# Altium project CM5 Nas.PrjPcb (part 1 of 2)
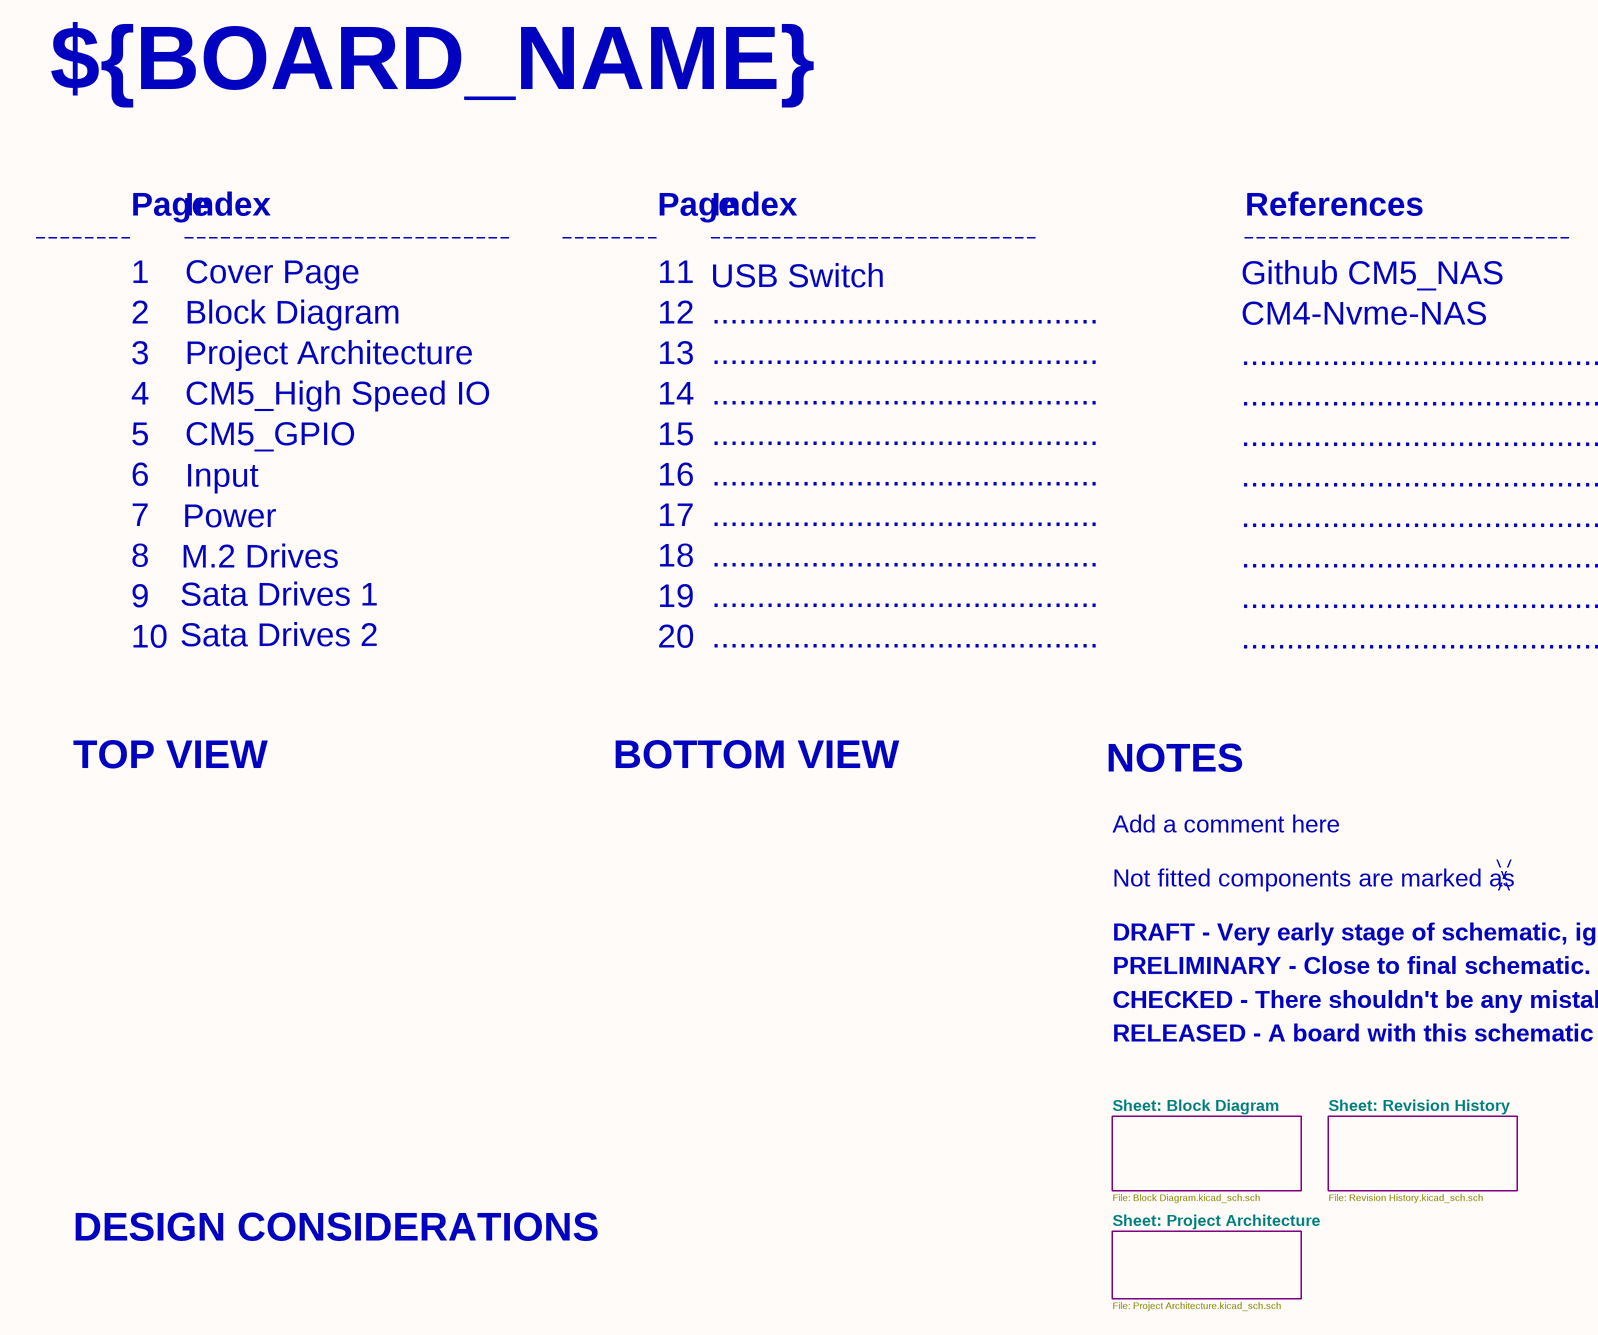
[diagram p0: CM5 Nas.SchDoc, left]
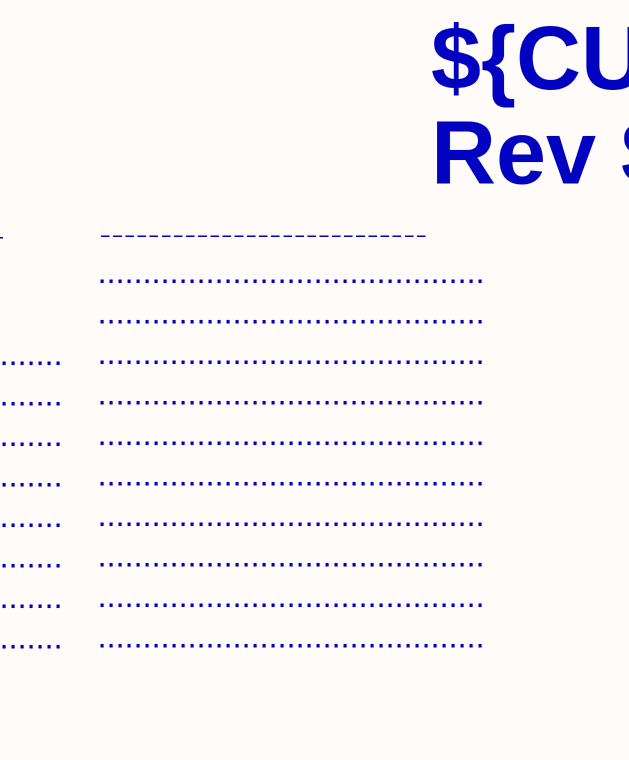
[diagram p1: CM5 Nas.SchDoc, right]
12 sheets, 380 parts. Net scope: flat (ports and power ports of the same name join across sheets).
Board file: CM5 Nas.PcbDoc
Sheets:
  CM5 Nas.SchDoc
    Block Diagram = Block Diagram.SchDoc
    Revision History = Revision History.SchDoc
    Project Architecture = Project Architecture.SchDoc
      M.2 Drives = Drives_M.2.SchDoc
      Sata Drives 2 = Sata_Drives2.SchDoc
      Power = Power.SchDoc
      Usb Switch = USB & Ethernet.SchDoc
      CM5_High Speed IO = Section A - Title A.SchDoc
      Sata Drives 1 = Sata_Drives.SchDoc
      CM5_GPIO = Section B - TItle B.SchDoc
      Input = untitled.SchDoc

## Sheet CM5 Nas.SchDoc
size 420 x 297 mm

### Sub-sheets
Block Diagram = Block Diagram.SchDoc: no entries
Project Architecture = Project Architecture.SchDoc: no entries
Revision History = Revision History.SchDoc: no entries

### Notes on the sheet
- ${BOARD_NAME}
- ${CURRENT_DATE}
- Page
- Index
- References
- Rev ${REVISION}
- 1
- Cover Page
- 11
- Github CM5_NAS
- ...........................................
- 2
- Block Diagram
- 12
- USB Switch
- CM4-Nvme-NAS
- 3
- 4
- CM5_High Speed IO
- Project Architecture
- 13
- 14
- 6
- 5
- CM5_GPIO
- 15
- 16
- 7
- Power
- Input
- 17
- 9
- 8
- Sata Drives 1
- M.2 Drives
- 18
- 19
- 10
- Sata Drives 2
- 20
- TOP VIEW
- BOTTOM VIEW
- NOTES
- Not fitted components are marked as
- Add a comment here
- DRAFT - Very early stage of schematic, ignore details.
- PRELIMINARY - Close to final schematic.
- CHECKED - There shouldn't be any mistakes. Contact the engineer if you find any.
- RELEASED - A board with this schematic has been sent to production.
- Sheet: Block Diagram
- Sheet: Revision History
- File: Block Diagram.kicad_sch.sch
- Sheet: Project Architecture
- File: Revision History.kicad_sch.sch
- DESIGN CONSIDERATIONS
- File: Project Architecture.kicad_sch.sch
- A
- B
- C
- D
- E
- Title: Cover Page
- File: CM5 Nas.kicad_sch
- Sheet: /
- F
- KiCad E.D.A.  kicad (5.1.4)-1
- Size: A3
- Date: Last Modified Date
- Rev: ${REVISION}
- Id: 1/1

## Sheet Block Diagram.SchDoc
size 420 x 297 mm
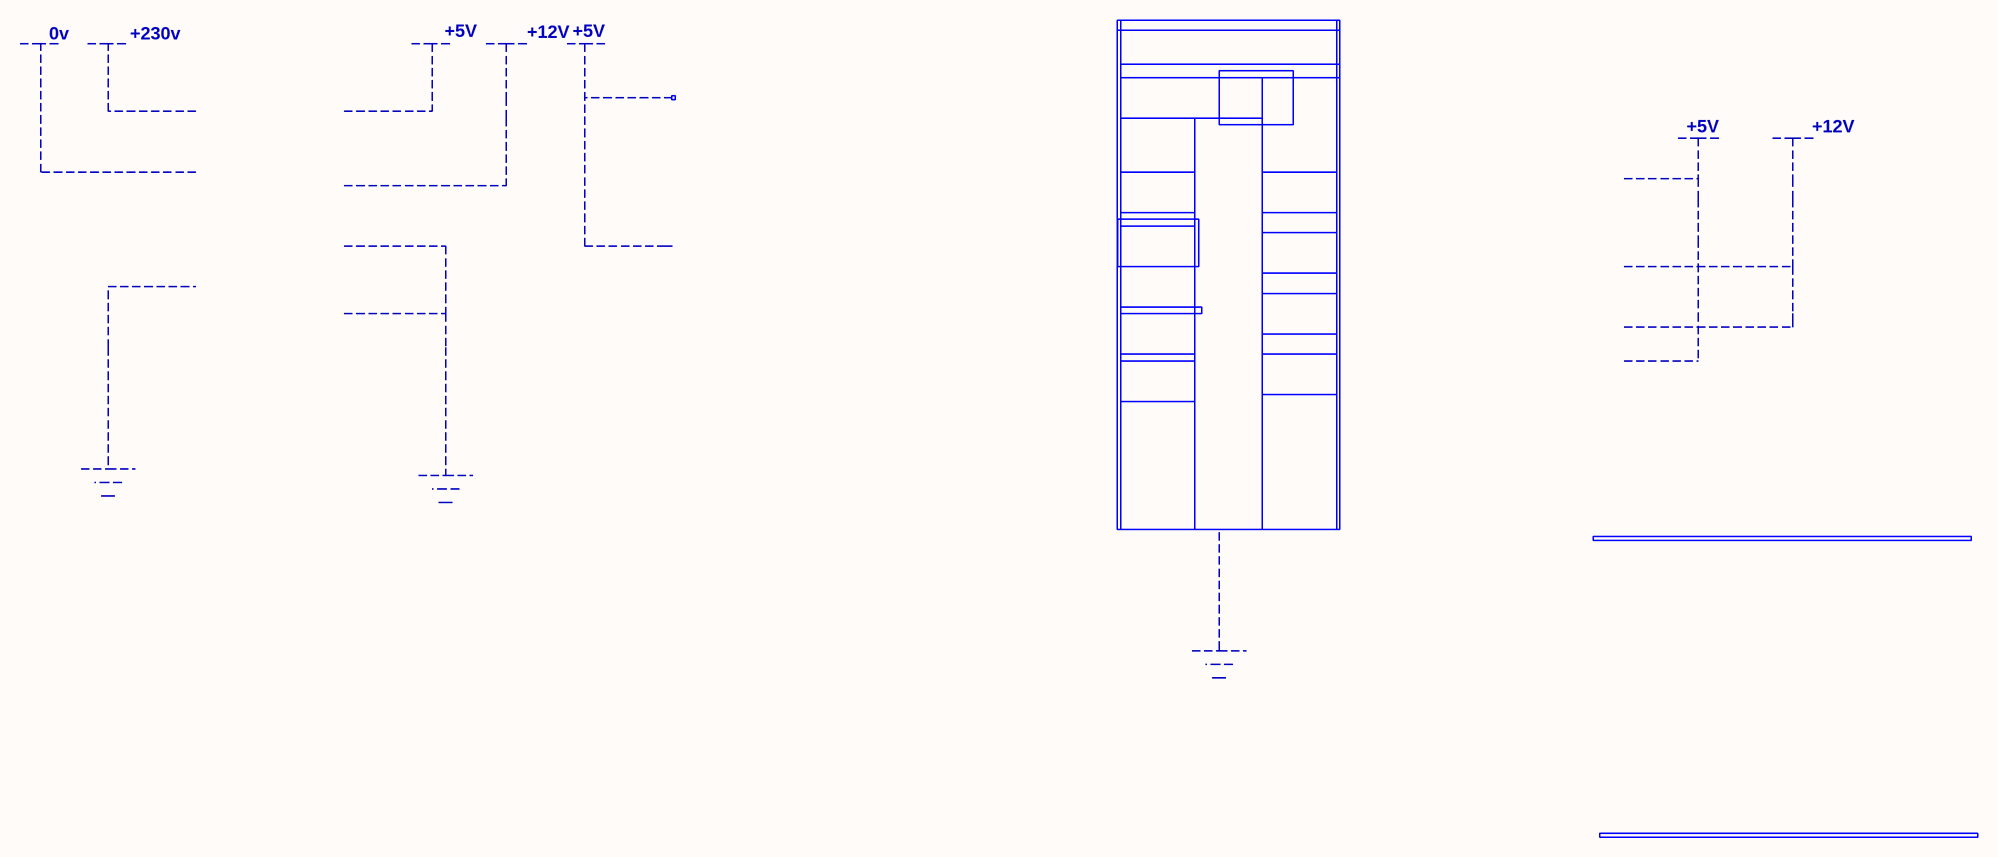
[diagram p2: Block Diagram.SchDoc]

### Notes on the sheet
- 0v
- +230v
- +5V
- +12V
- 1
- 2
- 3
- 4
- 5
- 6
- 7
- 8
- A
- B
- C
- D
- E
- Title: Block Diagram
- File: Block Diagram.kicad_sch
- Sheet: /
- ${COMPANY}
- F
- KiCad E.D.A.  kicad (5.1.4)-1
- Size: A3
- Date: Last Modified Date
- Rev: ${REVISION}
- Id: 1/1

## Sheet Revision History.SchDoc
size 297 x 209 mm

### Notes on the sheet
- 1
- 2
- 3
- 4
- 5
- 6
- A
- B
- C
- D
- Title: Revision History
- File: Revision History.kicad_sch
- Sheet: /
- ${COMPANY}
- KiCad E.D.A.  kicad (5.1.4)-1
- Size: A4
- Date: Last Modified Date
- Rev: ${REVISION}
- Id: 1/1
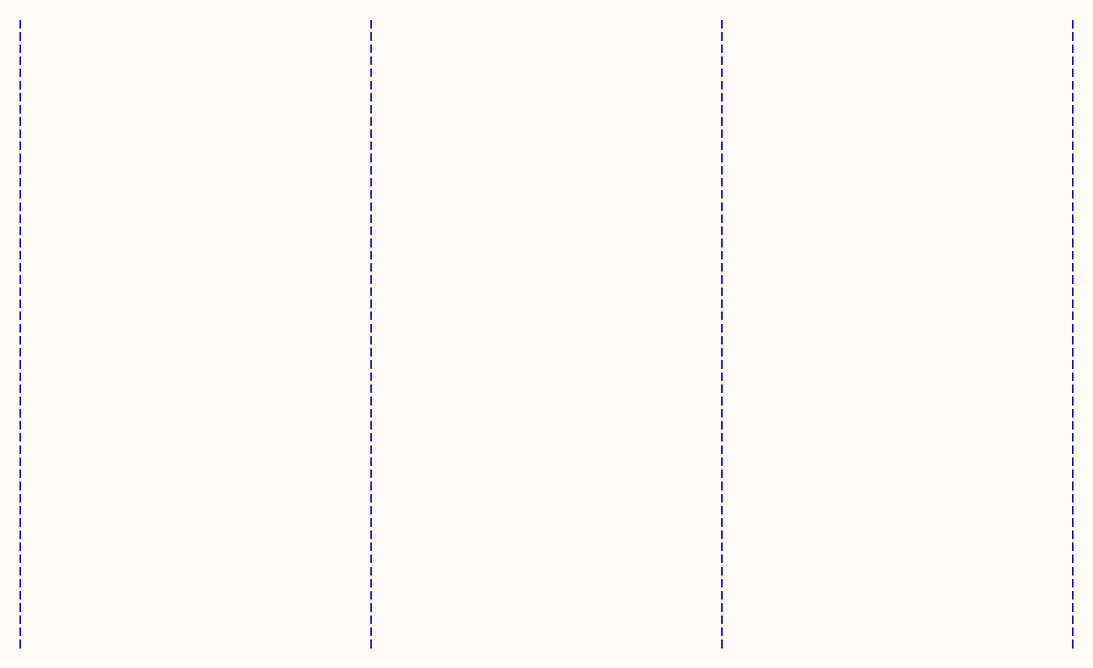
[diagram p3: Revision History.SchDoc]

## Sheet Project Architecture.SchDoc
size 420 x 297 mm
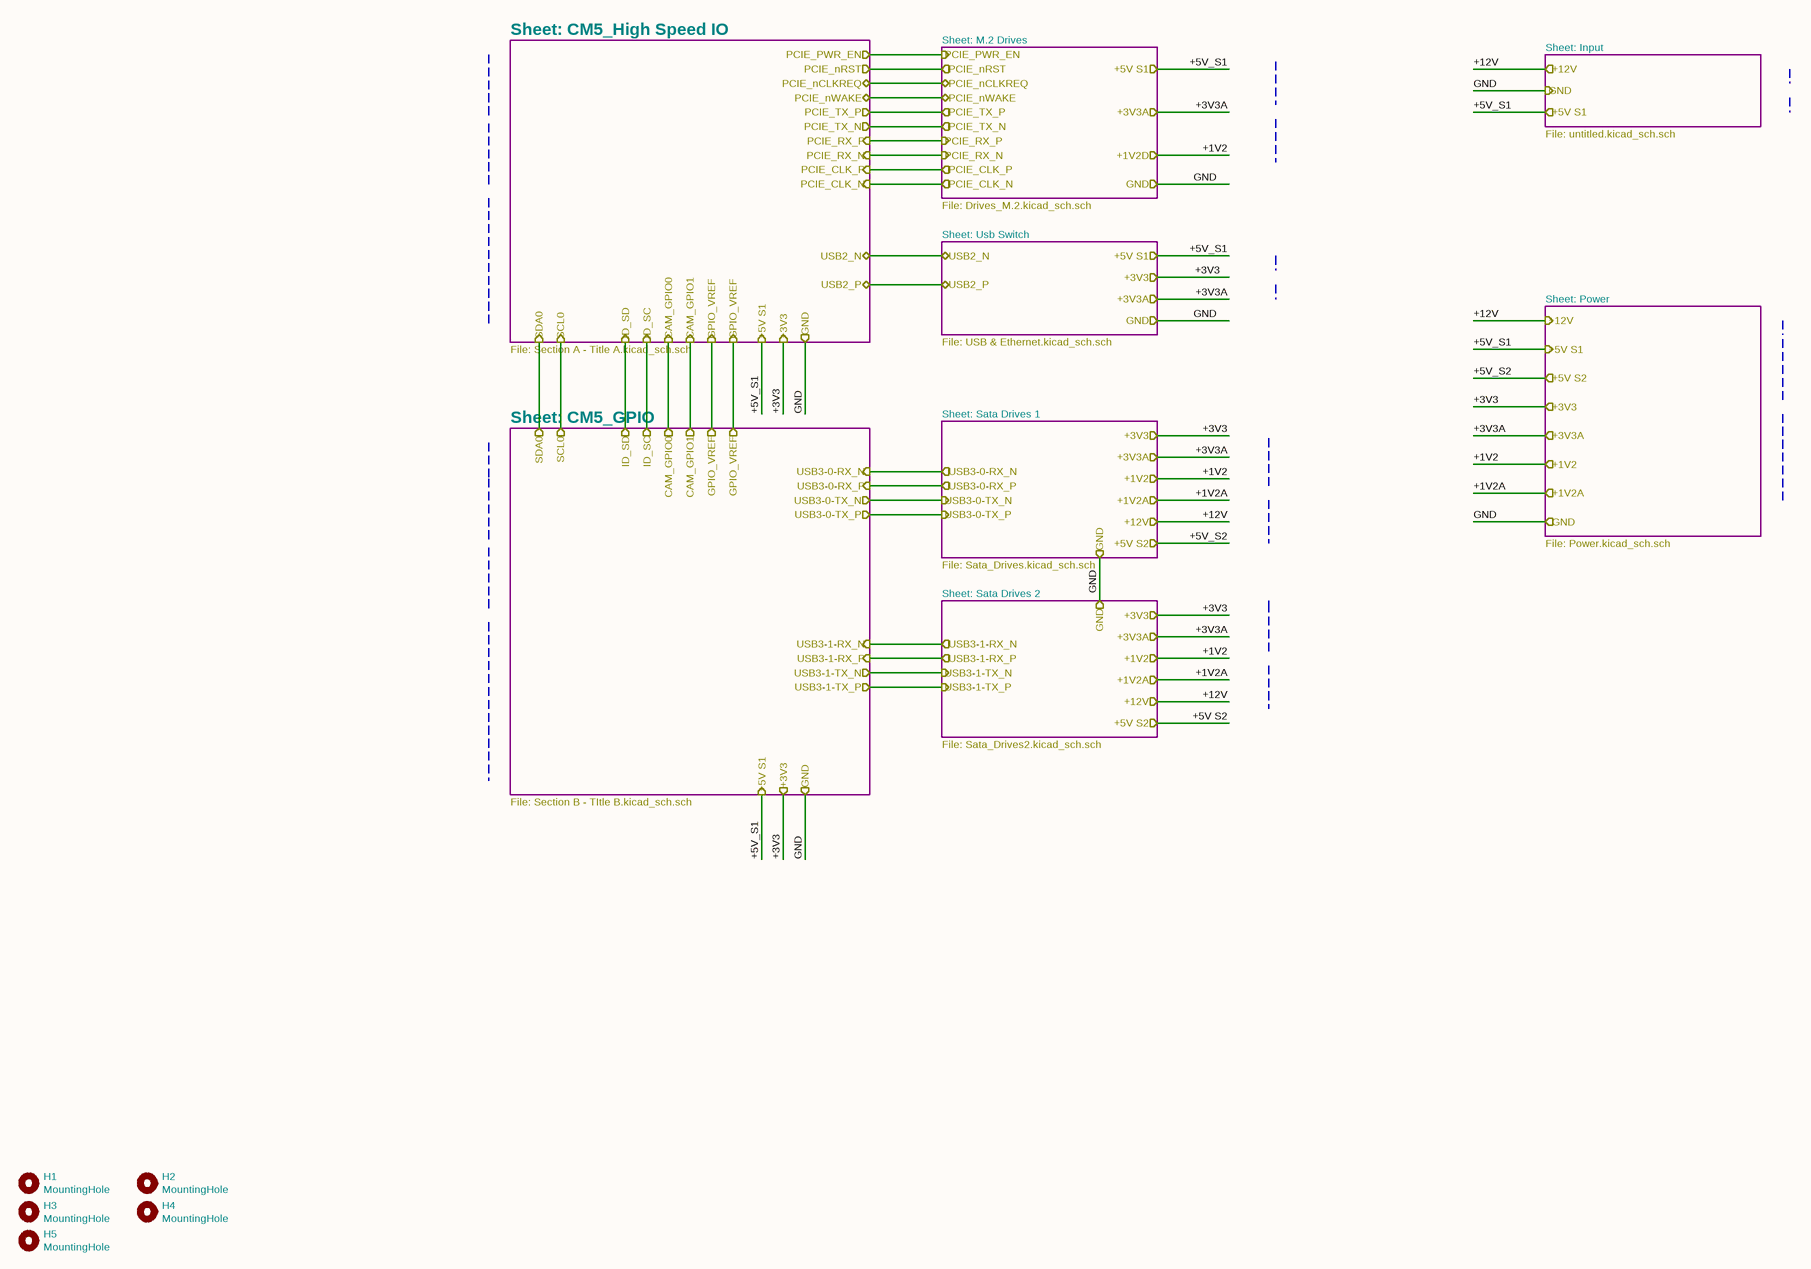
[diagram p4: Project Architecture.SchDoc]

### Parts
H1  MountingHole  [MountingHole_2.7mm_M2.5]
H2  MountingHole  [MountingHole_2.7mm_M2.5]
H3  MountingHole  [MountingHole_2.7mm_M2.5]
H4  MountingHole  [MountingHole_2.7mm_M2.5]
H5  MountingHole  [MountingHole_2.7mm_M2.5]

### Sub-sheets
CM5_GPIO = Section B - TItle B.SchDoc: no entries
CM5_High Speed IO = Section A - Title A.SchDoc: no entries
Input = untitled.SchDoc: no entries
M.2 Drives = Drives_M.2.SchDoc: no entries
Power = Power.SchDoc: no entries
Sata Drives 1 = Sata_Drives.SchDoc: no entries
Sata Drives 2 = Sata_Drives2.SchDoc: no entries
Usb Switch = USB & Ethernet.SchDoc: no entries

### Ports
+1V2 (in), +1V2A (in), +1V2D (in), +3V3 (in), +3V3 (out), +3V3A (in), +5V S1 (in), +5V S1 (out), +5V S2 (in), +12V (in), +12V (out), CAM_GPIO0 (in), CAM_GPIO0 (out), CAM_GPIO1 (in), CAM_GPIO1 (out), GND (in), GND (out), GPIO_VREF (in), GPIO_VREF (out), ID_SC (in), ID_SC (out), ID_SD (in), ID_SD (out), PCIE_CLK_N (in), PCIE_CLK_N (out), PCIE_CLK_P (in), PCIE_CLK_P (out), PCIE_nCLKREQ (bidir), PCIE_nRST (in), PCIE_nWAKE (bidir), PCIE_PWR_EN (in), PCIE_PWR_EN (out), PCIE_RX_N (out), PCIE_RX_P (out), PCIE_TX_N (in), PCIE_TX_P (in), SCL0 (in), SCL0 (out), SDA0 (in), SDA0 (out), USB2_N (bidir), USB2_P (bidir), USB3-0-RX_N (in), USB3-0-RX_N (out), USB3-0-RX_P (in), USB3-0-RX_P (out), USB3-0-TX_N (in), USB3-0-TX_N (out), USB3-0-TX_P (in), USB3-0-TX_P (out), USB3-1-RX_N (in), USB3-1-RX_N (out), USB3-1-RX_P (in), USB3-1-RX_P (out), USB3-1-TX_N (in), USB3-1-TX_N (out), USB3-1-TX_P (in), USB3-1-TX_P (out)

### Nets
+1V2: port +1V2, port +1V2D
GND: port GND

### Notes on the sheet
- Sheet: CM5_High Speed IO
- Sheet: M.2 Drives
- Sheet: Input
- File: untitled.kicad_sch.sch
- File: Drives_M.2.kicad_sch.sch
- Sheet: Usb Switch
- Sheet: Power
- File: Section A - Title A.kicad_sch.sch
- File: USB & Ethernet.kicad_sch.sch
- Sheet: CM5_GPIO
- Sheet: Sata Drives 1
- File: Power.kicad_sch.sch
- Sheet: Sata Drives 2
- File: Sata_Drives.kicad_sch.sch
- File: Sata_Drives2.kicad_sch.sch
- File: Section B - TItle B.kicad_sch.sch
- 1
- 2
- 3
- 4
- 5
- 6
- 7
- 8
- A
- B
- C
- D
- E
- Title: Project Architecture
- File: Project Architecture.kicad_sch
- Sheet: /
- ${COMPANY}
- F
- KiCad E.D.A.  kicad (5.1.4)-1
- Size: A3
- Date: Last Modified Date
- Rev: ${REVISION}
- Id: 1/1

### Library data of the parts
H1-H5 = MountingHole: Part Description: M2.5 mounting hole; Field4: nf; Field5: nf; Field6: nf; Field7: nf; Value: MountingHole; Footprint: MountingHole:MountingHole_2.7mm_M2.5

## Sheet Drives_M.2.SchDoc
size 420 x 297 mm
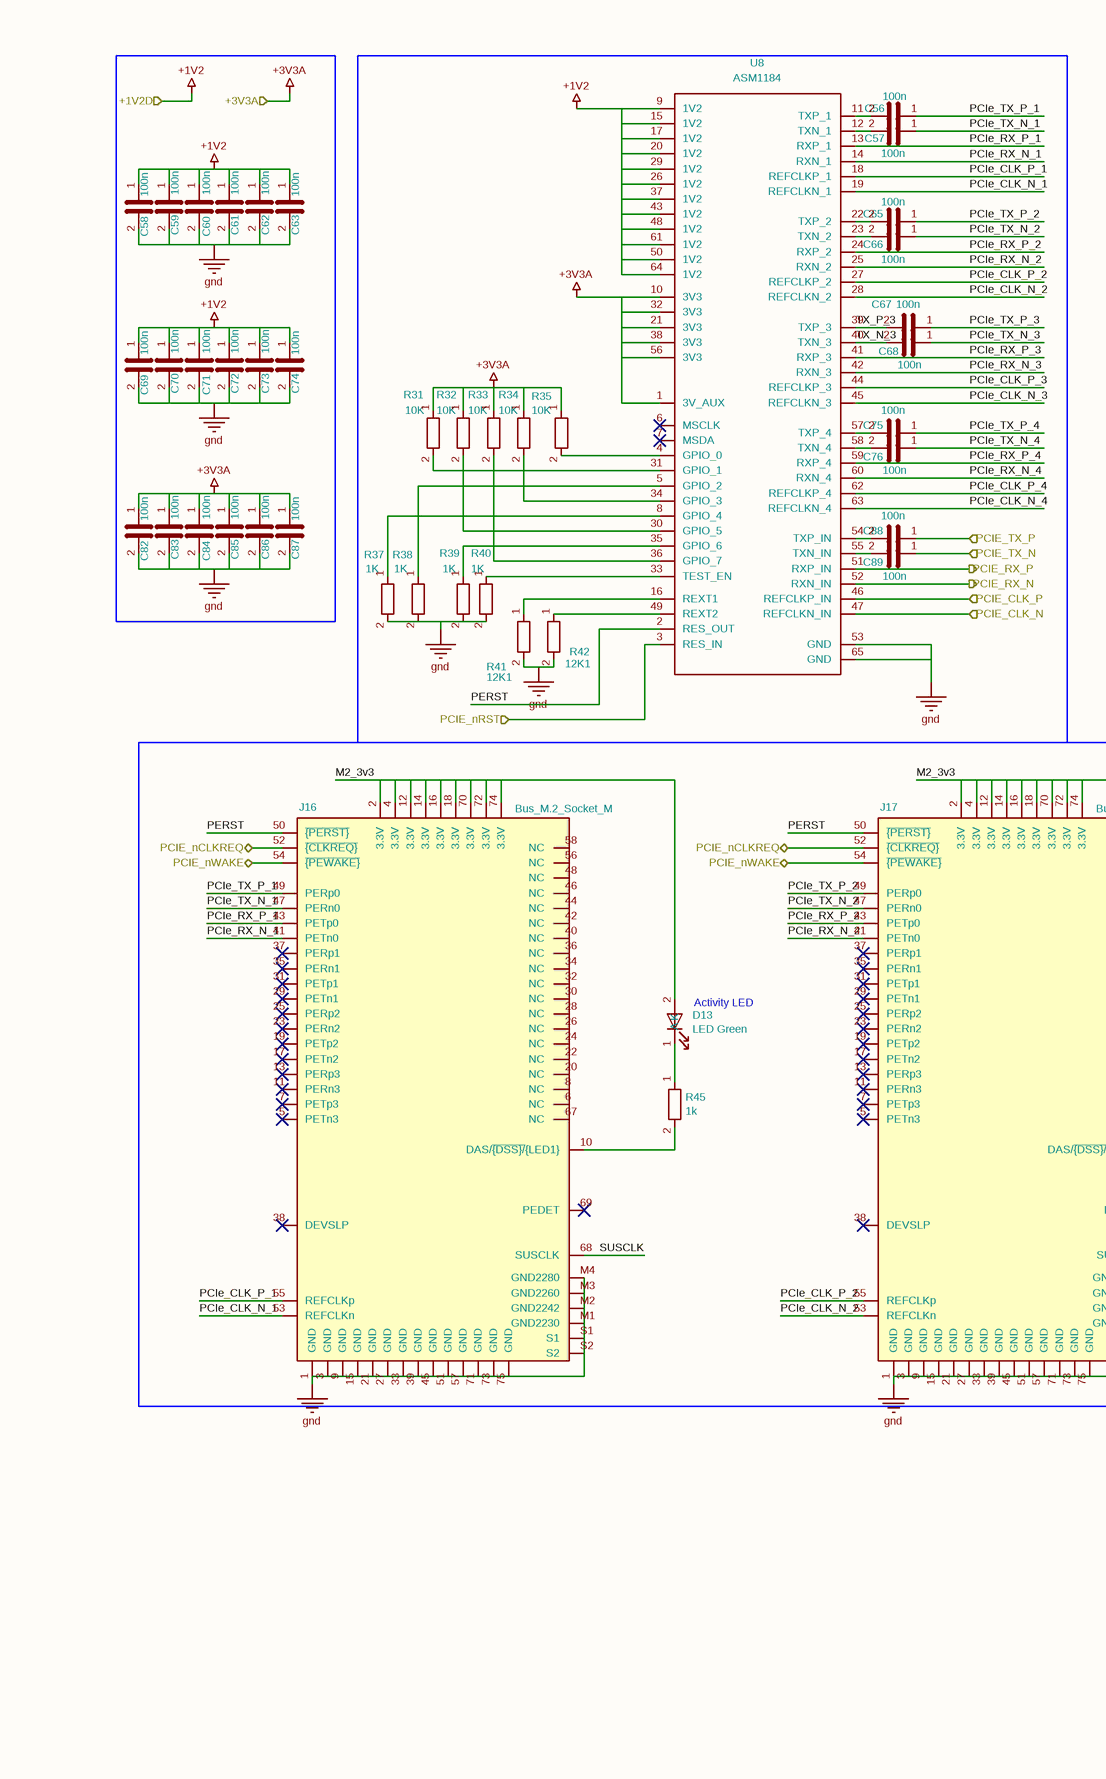
[diagram p5: Drives_M.2.SchDoc, left]
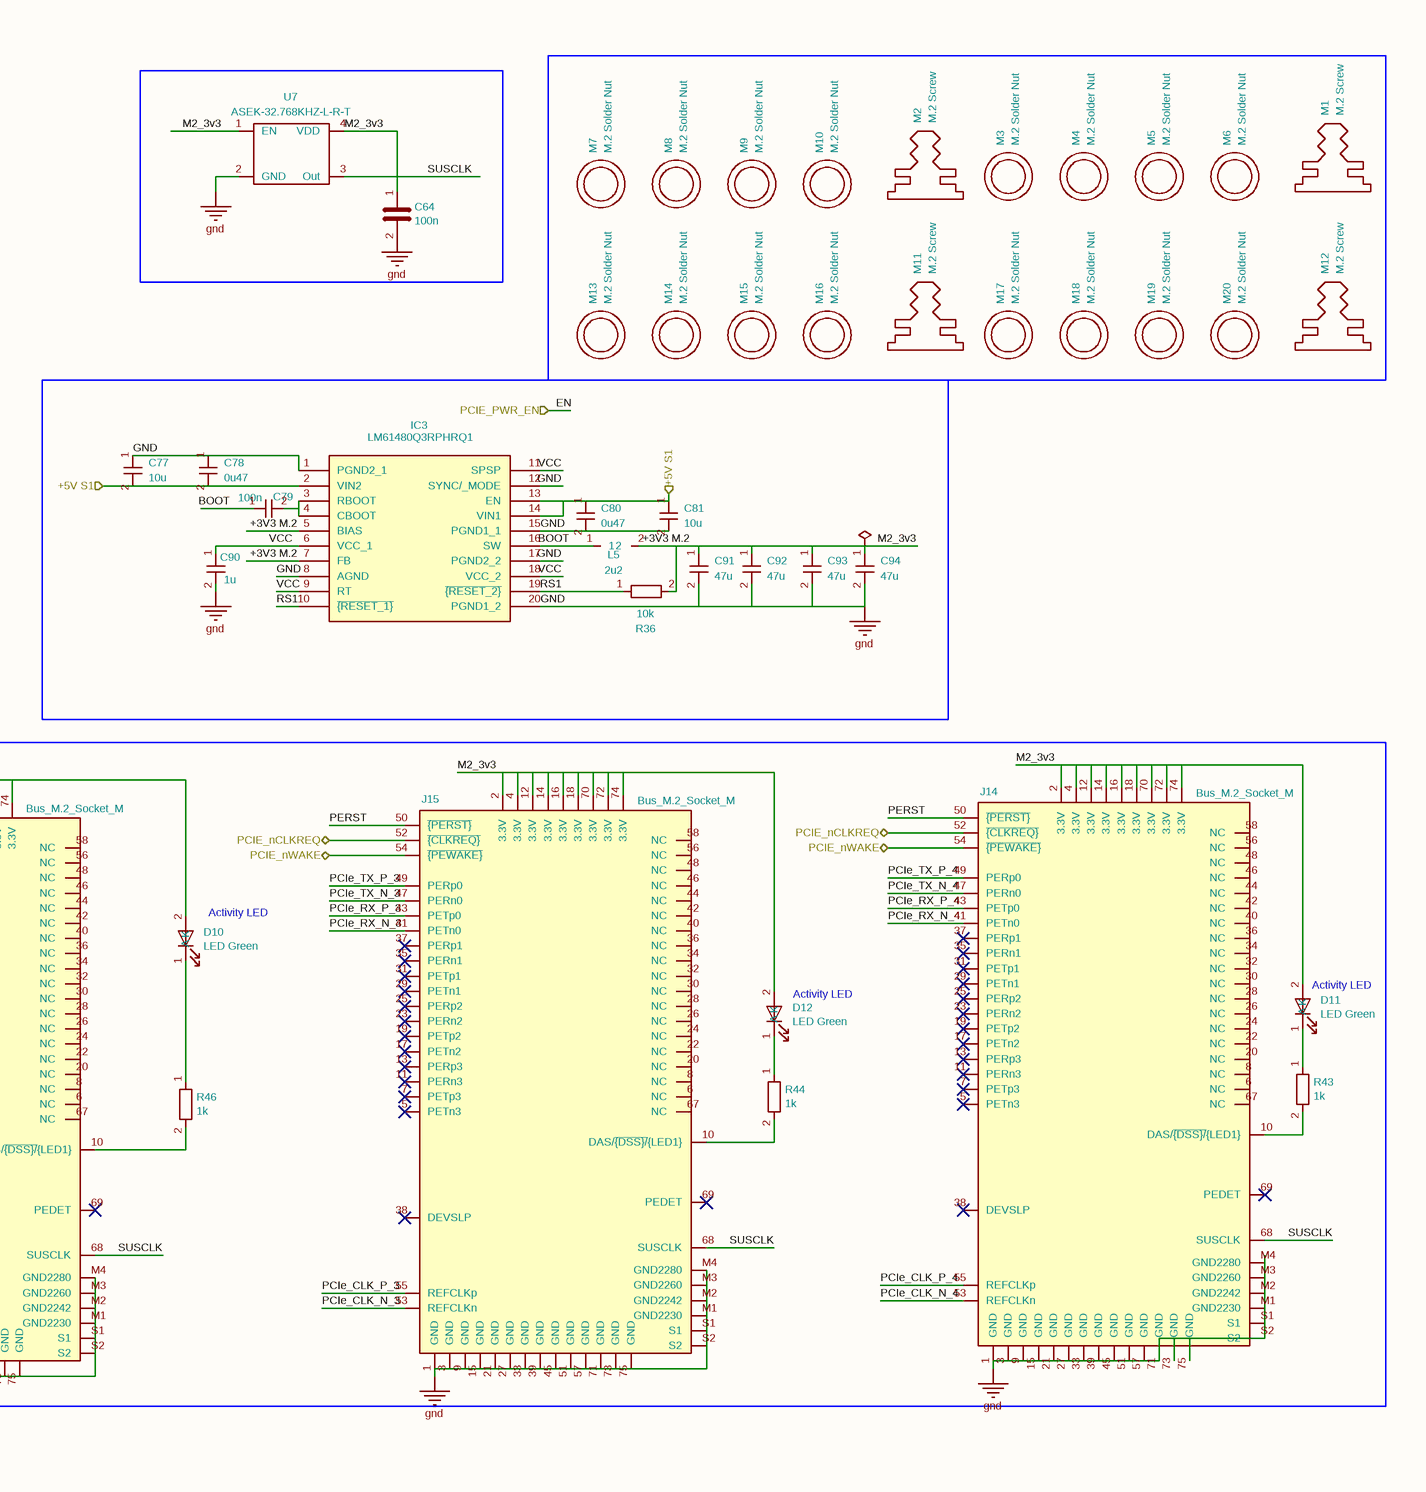
[diagram p6: Drives_M.2.SchDoc, right]

### Parts
#FLG09  PWR_FLAG  (value not drawn)  (graphical)
C56  100n  [C_0402_1005Metric]
C57  100n  [C_0402_1005Metric]
C58  100n  [C_0402_1005Metric]
C59  100n  [C_0402_1005Metric]
C60  100n  [C_0402_1005Metric]
C61  100n  [C_0402_1005Metric]
C62  100n  [C_0402_1005Metric]
C63  100n  [C_0402_1005Metric]
C64  100n  [C_0402_1005Metric]
C65  100n  [C_0402_1005Metric]
C66  100n  [C_0402_1005Metric]
C67  100n  [C_0402_1005Metric]
C68  100n  [C_0402_1005Metric]
C69  100n  [C_0402_1005Metric]
C70  100n  [C_0402_1005Metric]
C71  100n  [C_0402_1005Metric]
C72  100n  [C_0402_1005Metric]
C73  100n  [C_0402_1005Metric]
C74  100n  [C_0402_1005Metric]
C75  100n  [C_0402_1005Metric]
C76  100n  [C_0402_1005Metric]
C77  10u  [C_0805_2012Metric]
C78  0u47  [C_0603_1608Metric]
C79  100n  [C_0402_1005Metric]
C80  0u47  [C_0603_1608Metric]
C81  10u  [C_0805_2012Metric]
C82  100n  [C_0402_1005Metric]
C83  100n  [C_0402_1005Metric]
C84  100n  [C_0402_1005Metric]
C85  100n  [C_0402_1005Metric]
C86  100n  [C_0402_1005Metric]
C87  100n  [C_0402_1005Metric]
C88  100n  [C_0402_1005Metric]
C89  100n  [C_0402_1005Metric]
C90  1u  [C_0805_2012Metric]
C91  47u  [C_0805_2012Metric]
C92  47u  [C_0805_2012Metric]
C93  47u  [C_0805_2012Metric]
C94  47u  [C_0805_2012Metric]
D10  LED Green  [LED_0603_1608Metric]
D11  LED Green  [LED_0603_1608Metric]
D12  LED Green  [LED_0603_1608Metric]
D13  LED Green  [LED_0603_1608Metric]
IC3  LM61480Q3RPHRQ1  [LM62460QRPHRQ1]
J14  Bus_M.2_Socket_M  [21991195]
J15  Bus_M.2_Socket_M  [21991195]
J16  Bus_M.2_Socket_M  [21991195]
J17  Bus_M.2_Socket_M  [21991195]
L5  2u2  [SRN50402R2Y]
M1  M.2 Screw
M2  M.2 Screw
M3  M.2 Solder Nut
M4  M.2 Solder Nut
M5  M.2 Solder Nut
M6  M.2 Solder Nut
M7  M.2 Solder Nut
M8  M.2 Solder Nut
M9  M.2 Solder Nut
M10  M.2 Solder Nut
M11  M.2 Screw
M12  M.2 Screw
M13  M.2 Solder Nut
M14  M.2 Solder Nut
M15  M.2 Solder Nut
M16  M.2 Solder Nut
M17  M.2 Solder Nut
M18  M.2 Solder Nut
M19  M.2 Solder Nut
M20  M.2 Solder Nut
R31  10K  [R_0603_1608Metric]
R32  10K  [R_0603_1608Metric]
R33  10K  [R_0603_1608Metric]
R34  10K  [R_0603_1608Metric]
R35  10K  [R_0603_1608Metric]
R36  10k  [R_0402_1005Metric]
R37  1K  [R_0603_1608Metric]
R38  1K  [R_0603_1608Metric]
R39  1K  [R_0603_1608Metric]
R40  1K  [R_0603_1608Metric]
R41  12K1  [R_0603_1608Metric]
R42  12K1  [R_0603_1608Metric]
R43  1k  [R_0603_1608Metric]
R44  1k  [R_0603_1608Metric]
R45  1k  [R_0603_1608Metric]
R46  1k  [R_0603_1608Metric]
U7  ASEK-32.768KHZ-L-R-T  [Crystal_SMD_3225-4Pin_3.2x2.5mm]
U8  ASM1184  [QFN-64-1EP_9x9mm_P0.5mm_EP5.2x5.2mm_ThermalVias]

### Ports
+1V2D (in), +3V3A (in), +5V S1 (in), PCIE_CLK_N (in), PCIE_CLK_P (in), PCIE_nCLKREQ (bidir), PCIE_nRST (in), PCIE_nWAKE (bidir), PCIE_PWR_EN (in), PCIE_RX_N (out), PCIE_RX_P (out), PCIE_TX_N (in), PCIE_TX_P (in)

### Nets
+1V2: C58.1 C59.1 C60.1 C61.1 C62.1 C63.1 C69.1 C70.1 C71.1 C72.1 C73.1 C74.1 U8.9(1V2) U8.15(1V2) U8.17(1V2) U8.20(1V2) U8.26(1V2) U8.29(1V2) U8.37(1V2) U8.43(1V2) U8.48(1V2) U8.50(1V2) U8.61(1V2) U8.64(1V2) ; port +1V2D
+3V3A: C82.1 C83.1 C84.1 C85.1 C86.1 C87.1 R31.1 R32.1 R33.1 R34.1 R35.1 U8.1(3V_AUX) U8.10(3V3) U8.21(3V3) U8.32(3V3) U8.38(3V3) U8.56(3V3) ; port +3V3A
GND: C58.2 C59.2 C60.2 C61.2 C62.2 C63.2 C64.2 C69.2 C70.2 C71.2 C72.2 C73.2 C74.2 C77.1 C78.1 C80.2 C81.2 C82.2 C83.2 C84.2 C85.2 C86.2 C87.2 C90.2 C91.2 C92.2 C93.2 C94.2 IC3.1(PGND2_1) IC3.8(AGND) IC3.12(SYNC/_MODE) IC3.15(PGND1_1) IC3.17(PGND2_2) IC3.20(PGND1_2) J14.1(GND) J14.3(GND) J14.9(GND) J14.15(GND) J14.21(GND) J14.27(GND) J14.33(GND) J14.39(GND) J14.45(GND) J14.51(GND) J14.57(GND) J14.71(GND) J14.73(GND) J14.75(GND) J14.M1(GND2230) J14.M2(GND2242) J14.M3(GND2260) J14.M4(GND2280) J14.S1 J14.S2 J15.1(GND) J15.3(GND) J15.9(GND) J15.15(GND) J15.21(GND) J15.27(GND) J15.33(GND) J15.39(GND) J15.45(GND) J15.51(GND) J15.57(GND) J15.71(GND) J15.73(GND) J15.75(GND) J15.M1(GND2230) J15.M2(GND2242) J15.M3(GND2260) J15.M4(GND2280) J15.S1 J15.S2 J16.1(GND) J16.3(GND) J16.9(GND) J16.15(GND) J16.21(GND) J16.27(GND) J16.33(GND) J16.39(GND) J16.45(GND) J16.51(GND) J16.57(GND) J16.71(GND) J16.73(GND) J16.75(GND) J16.M1(GND2230) J16.M2(GND2242) J16.M3(GND2260) J16.M4(GND2280) J16.S1 J16.S2 J17.1(GND) J17.3(GND) J17.9(GND) J17.15(GND) J17.21(GND) J17.27(GND) J17.33(GND) J17.39(GND) J17.45(GND) J17.51(GND) J17.57(GND) J17.71(GND) J17.73(GND) J17.75(GND) J17.M1(GND2230) J17.M2(GND2242) J17.M3(GND2260) J17.M4(GND2280) J17.S1 J17.S2 R37.2 R38.2 R39.2 R40.2 R41.2 R42.2 U7.2(GND) U8.53(GND) U8.65(GND)
+3V3 M.2: #FLG09.1 C64.1 C91.1 C92.1 C93.1 C94.1 D10.2(A) D11.2(A) D12.2(A) D13.2(A) IC3.5(BIAS) IC3.7(FB) J14.2(3.3V) J14.4(3.3V) J14.12(3.3V) J14.14(3.3V) J14.16(3.3V) J14.18(3.3V) J14.70(3.3V) J14.72(3.3V) J14.74(3.3V) J15.2(3.3V) J15.4(3.3V) J15.12(3.3V) J15.14(3.3V) J15.16(3.3V) J15.18(3.3V) J15.70(3.3V) J15.72(3.3V) J15.74(3.3V) J16.2(3.3V) J16.4(3.3V) J16.12(3.3V) J16.14(3.3V) J16.16(3.3V) J16.18(3.3V) J16.70(3.3V) J16.72(3.3V) J16.74(3.3V) J17.2(3.3V) J17.4(3.3V) J17.12(3.3V) J17.14(3.3V) J17.16(3.3V) J17.18(3.3V) J17.70(3.3V) J17.72(3.3V) J17.74(3.3V) L5.2 R36.2 U7.1(EN) U7.4(VDD)  [also labelled M2_3v3]
+5V: C77.2 C78.2 C80.1 C81.1 IC3.2(VIN2) IC3.13(EN) IC3.14(VIN1) ; port +5V S1
BOOT: C79.1 IC3.16(SW) L5.1
PCIE_CLK_N: U8.47(REFCLKN_IN) ; port PCIE_CLK_N
PCIe_CLK_N_1: J16.53(REFCLKn) U8.19(REFCLKN_1)
PCIe_CLK_N_2: J17.53(REFCLKn) U8.28(REFCLKN_2)
PCIe_CLK_N_3: J15.53(REFCLKn) U8.45(REFCLKN_3)
PCIe_CLK_N_4: J14.53(REFCLKn) U8.63(REFCLKN_4)
PCIE_CLK_P: U8.46(REFCLKP_IN) ; port PCIE_CLK_P
PCIe_CLK_P_1: J16.55(REFCLKp) U8.18(REFCLKP_1)
PCIe_CLK_P_2: J17.55(REFCLKp) U8.27(REFCLKP_2)
PCIe_CLK_P_3: J15.55(REFCLKp) U8.44(REFCLKP_3)
PCIe_CLK_P_4: J14.55(REFCLKp) U8.62(REFCLKP_4)
PCIE_nCLKREQ: J14.52(~{{CLKREQ}}) J15.52(~{{CLKREQ}}) J16.52(~{{CLKREQ}}) J17.52(~{{CLKREQ}}) ; port PCIE_nCLKREQ
PCIE_nRST: U8.3(RES_IN) ; port PCIE_nRST
PCIE_nWAKE: J14.54(~{{PEWAKE}}) J15.54(~{{PEWAKE}}) J16.54(~{{PEWAKE}}) J17.54(~{{PEWAKE}}) ; port PCIE_nWAKE
PCIE_RX_N: U8.52(RXN_IN) ; port PCIE_RX_N
PCIe_RX_N_1: J16.41(PETn0) U8.14(RXN_1)
PCIe_RX_N_2: J17.41(PETn0) U8.25(RXN_2)
PCIe_RX_N_3: J15.41(PETn0) U8.42(RXN_3)
PCIe_RX_N_4: J14.41(PETn0) U8.60(RXN_4)
PCIE_RX_P: U8.51(RXP_IN) ; port PCIE_RX_P
PCIe_RX_P_1: J16.43(PETp0) U8.13(RXP_1)
PCIe_RX_P_2: J17.43(PETp0) U8.24(RXP_2)
PCIe_RX_P_3: J15.43(PETp0) U8.41(RXP_3)
PCIe_RX_P_4: J14.43(PETp0) U8.59(RXP_4)
PCIE_TX_N: C89.1 ; port PCIE_TX_N
PCIe_TX_N_1: C57.1 J16.47(PERn0)
PCIe_TX_N_2: C66.1 J17.47(PERn0)
PCIe_TX_N_3: C68.1 J15.47(PERn0)
PCIe_TX_N_4: C76.1 J14.47(PERn0)
PCIE_TX_P: C88.1 ; port PCIE_TX_P
PCIe_TX_P_1: C56.1 J16.49(PERp0)
PCIe_TX_P_2: C65.1 J17.49(PERp0)
PCIe_TX_P_3: C67.1 J15.49(PERp0)
PCIe_TX_P_4: C75.1 J14.49(PERp0)
PERST: J14.50(~{{PERST}}) J15.50(~{{PERST}}) J16.50(~{{PERST}}) J17.50(~{{PERST}}) U8.2(RES_OUT)
RS1: IC3.10(~{{RESET_1}}) IC3.19(~{{RESET_2}}) R36.1
SUSCLK: J14.68(SUSCLK) J15.68(SUSCLK) J16.68(SUSCLK) J17.68(SUSCLK) U7.3(Out)
TX_N_3: C68.2 U8.40(TXN_3)
TX_P_3: C67.2 U8.39(TXP_3)
VCC: C90.1 IC3.6(VCC_1) IC3.9(RT) IC3.11(SPSP) IC3.18(VCC_2)
NetC56_2: C56.2 U8.11(TXP_1)
NetC57_2: C57.2 U8.12(TXN_1)
NetC65_2: C65.2 U8.22(TXP_2)
NetC66_2: C66.2 U8.23(TXN_2)
NetC75_2: C75.2 U8.57(TXP_4)
NetC76_2: C76.2 U8.58(TXN_4)
NetC79_2: C79.2 IC3.3(RBOOT) IC3.4(CBOOT)
NetC88_2: C88.2 U8.54(TXP_IN)
NetC89_2: C89.2 U8.55(TXN_IN)
NetD10_1: D10.1(K) R46.1
NetD11_1: D11.1(K) R43.1
NetD12_1: D12.1(K) R44.1
NetD13_1: D13.1(K) R45.1
NetJ14_10: J14.10(DAS/~{{DSS}/}{LED1}) R43.2
NetJ15_10: J15.10(DAS/~{{DSS}/}{LED1}) R44.2
NetJ16_10: J16.10(DAS/~{{DSS}/}{LED1}) R45.2
NetJ17_10: J17.10(DAS/~{{DSS}/}{LED1}) R46.2
NetR31_2: R31.2 U8.31(GPIO_1)
NetR32_2: R32.2 U8.30(GPIO_5)
NetR33_2: R33.2 U8.36(GPIO_7)
NetR34_2: R34.2 U8.34(GPIO_3)
NetR35_2: R35.2 U8.4(GPIO_0)
NetR37_1: R37.1 U8.8(GPIO_4)
NetR38_1: R38.1 U8.5(GPIO_2)
NetR39_1: R39.1 U8.35(GPIO_6)
NetR40_1: R40.1 U8.33(TEST_EN)
NetR41_1: R41.1 U8.16(REXT1)
NetR42_1: R42.1 U8.49(REXT2)

Not connected (* = marked no-connect by the designer): J14 5(PETn3)* 6(NC) 7(PETp3)* 8(NC) 11(PERn3)* 13(PERp3)* 17(PETn2)* 19(PETp2)* 20(NC) 22(NC) 23(PERn2)* 24(NC) 25(PERp2)* 26(NC) 28(NC) 29(PETn1)* 30(NC) 31(PETp1)* 32(NC) 34(NC) 35(PERn1)* 36(NC) 37(PERp1)* 38(DEVSLP)* 40(NC) 42(NC) 44(NC) 46(NC) 48(NC) 56(NC) 58(NC) 67(NC) 69(PEDET)*; J15 5(PETn3)* 6(NC) 7(PETp3)* 8(NC) 11(PERn3)* 13(PERp3)* 17(PETn2)* 19(PETp2)* 20(NC) 22(NC) 23(PERn2)* 24(NC) 25(PERp2)* 26(NC) 28(NC) 29(PETn1)* 30(NC) 31(PETp1)* 32(NC) 34(NC) 35(PERn1)* 36(NC) 37(PERp1)* 38(DEVSLP)* 40(NC) 42(NC) 44(NC) 46(NC) 48(NC) 56(NC) 58(NC) 67(NC) 69(PEDET)*; J16 5(PETn3)* 6(NC) 7(PETp3)* 8(NC) 11(PERn3)* 13(PERp3)* 17(PETn2)* 19(PETp2)* 20(NC) 22(NC) 23(PERn2)* 24(NC) 25(PERp2)* 26(NC) 28(NC) 29(PETn1)* 30(NC) 31(PETp1)* 32(NC) 34(NC) 35(PERn1)* 36(NC) 37(PERp1)* 38(DEVSLP)* 40(NC) 42(NC) 44(NC) 46(NC) 48(NC) 56(NC) 58(NC) 67(NC) 69(PEDET)*; J17 5(PETn3)* 6(NC) 7(PETp3)* 8(NC) 11(PERn3)* 13(PERp3)* 17(PETn2)* 19(PETp2)* 20(NC) 22(NC) 23(PERn2)* 24(NC) 25(PERp2)* 26(NC) 28(NC) 29(PETn1)* 30(NC) 31(PETp1)* 32(NC) 34(NC) 35(PERn1)* 36(NC) 37(PERp1)* 38(DEVSLP)* 40(NC) 42(NC) 44(NC) 46(NC) 48(NC) 56(NC) 58(NC) 67(NC) 69(PEDET)*; U8 6(MSCLK)* 7(MSDA)*

### Notes on the sheet
- (near D10) Activity LED
- (near D13) Activity LED
- (near D12) Activity LED
- (near D11) Activity LED
- 1
- 2
- 3
- 4
- 5
- 6
- 7
- 8
- A
- B
- C
- D
- E
- Title:
- File: Drives_M.2.kicad_sch
- Sheet: /
- F
- KiCad E.D.A.  kicad (5.1.4)-1
- Size: A3
- Date:
- Rev:
- Id: 1/1

### Library data of the parts
#FLG09 = PWR_FLAG: Description: Special symbol for telling ERC where power comes from; Value: PWR_FLAG
C56-C63 C65-C76 C82-C89 = C: Value: 100n; Footprint: Capacitor_SMD:C_0402_1005Metric
C64 = C: Part Description: 0.1uF 10% 16V Ceramic Capacitor X7R 0402 (1005 Metric); Field4: Farnell; Field5: 2611911; Field6: RM EMK105 B7104KV-F; Field7: TAIYO YUDEN EUROPE GMBH; Field8: 110091611; Value: 100n; Footprint: Capacitor_SMD:C_0402_1005Metric
C77-C81 C90-C94 = C_Small: Description: Unpolarized capacitor, small symbol
  C77 C81: Value: 10u; Footprint: Capacitor_SMD:C_0805_2012Metric
  C78 C80: Value: 0u47; Footprint: Capacitor_SMD:C_0603_1608Metric
  C79: Value: 100n; Footprint: Capacitor_SMD:C_0402_1005Metric
  C90: Value: 1u; Footprint: Capacitor_SMD:C_0805_2012Metric
  C91-C94: Value: 47u; Footprint: Capacitor_SMD:C_0805_2012Metric
D10-D13 = LED: Part Description: Green 572nm LED Indication - Discrete 2.2V 2-SMD, No Lead; Field4: Digikey; Field5: LTST-S270KGKT; Field6: SML-A12M8TT86N; Field7: Rohm; Field8: 650263301; Value: LED Green; Footprint: LED_SMD:LED_0603_1608Metric
IC3 = LM61480Q3RPHRQ1: Manufacturer_Name: Texas Instruments; Description: Switching Voltage Regulators 8-A automotive buck converter optimized for power density and low EMI; Height: 1; Manufacturer_Part_Number: LM61480Q3RPHRQ1; Mouser Part Number: 595-LM61480Q3RPHRQ1; Mouser Price/Stock: https://www.mouser.co.uk/ProductDetail/Texas-Instruments/LM61480Q3RPHRQ1?qs=Wj%2FVkw3K%252BMDMY%2FXxTFEmEg%3D%3D; Arrow Part Number: LM61480Q3RPHRQ1; Arrow Price/Stock: https://www.arrow.com/en/products/lm61480q3rphrq1/texas-instruments?utm_currency=USD&region=nac; Value: LM61480Q3RPHRQ1; Footprint: LIB_LM61480Q3RPHRQ1:LM62460QRPHRQ1
J14-J17 = Bus_M.2_Socket_M: Part Description: M.2 M Key connector; Description: M.2 Socket 3 Mechanical Key M; Field5: MTSSD03-67MSW337; Field7: MTCONN; Field6: MTSSD03-67MSW337; Value: Bus_M.2_Socket_M; Footprint: 2199119-5:21991195
L5 = L: Description: Inductor; Value: 2u2; Footprint: SRN5040-2R2Y:SRN50402R2Y
M1 M2 M11 M12 = M.2_Screw: Part Description: M.2 Screw; Value: M.2 Screw
M3-M10 M13-M20 = SolderNut: Part Description: Solder nut for M.2 slot; Value: M.2 Solder Nut
R31-R35 R37-R42 = R: Footprint: Resistor_SMD:R_0603_1608Metric
  R31-R35: Value: 10K
  R37-R40: Value: 1K
  R41 R42: Value: 12K1
R36 = R: Description: Resistor; Value: 10k; Footprint: Resistor_SMD:R_0402_1005Metric
R43-R46 = R: Part Description: Resistor 1K M1005 1% 63mW; Field4: Farnell; Field5: 9239235; Field7: KOA EUROPE GMBH; Field6: RK73H1ETTP1001F; Field8: 125049511; Value: 1k; Footprint: Resistor_SMD:R_0603_1608Metric
U7 = ASEK-32.768KHZ-L-R-T: Part Description: 32KHz Xtal oscilator; Field7: abracon; Field5: ASEK-32.768KHZ-L-R-T; Field6: ASEK-32.768KHZ-L-R-T; Value: ASEK-32.768KHZ-L-R-T; Footprint: Crystal:Crystal_SMD_3225-4Pin_3.2x2.5mm
U8 = ASM1184: Value: ASM1184; Footprint: Package_DFN_QFN:QFN-64-1EP_9x9mm_P0.5mm_EP5.2x5.2mm_ThermalVias

## Sheet Sata_Drives2.SchDoc
size 309 x 209 mm
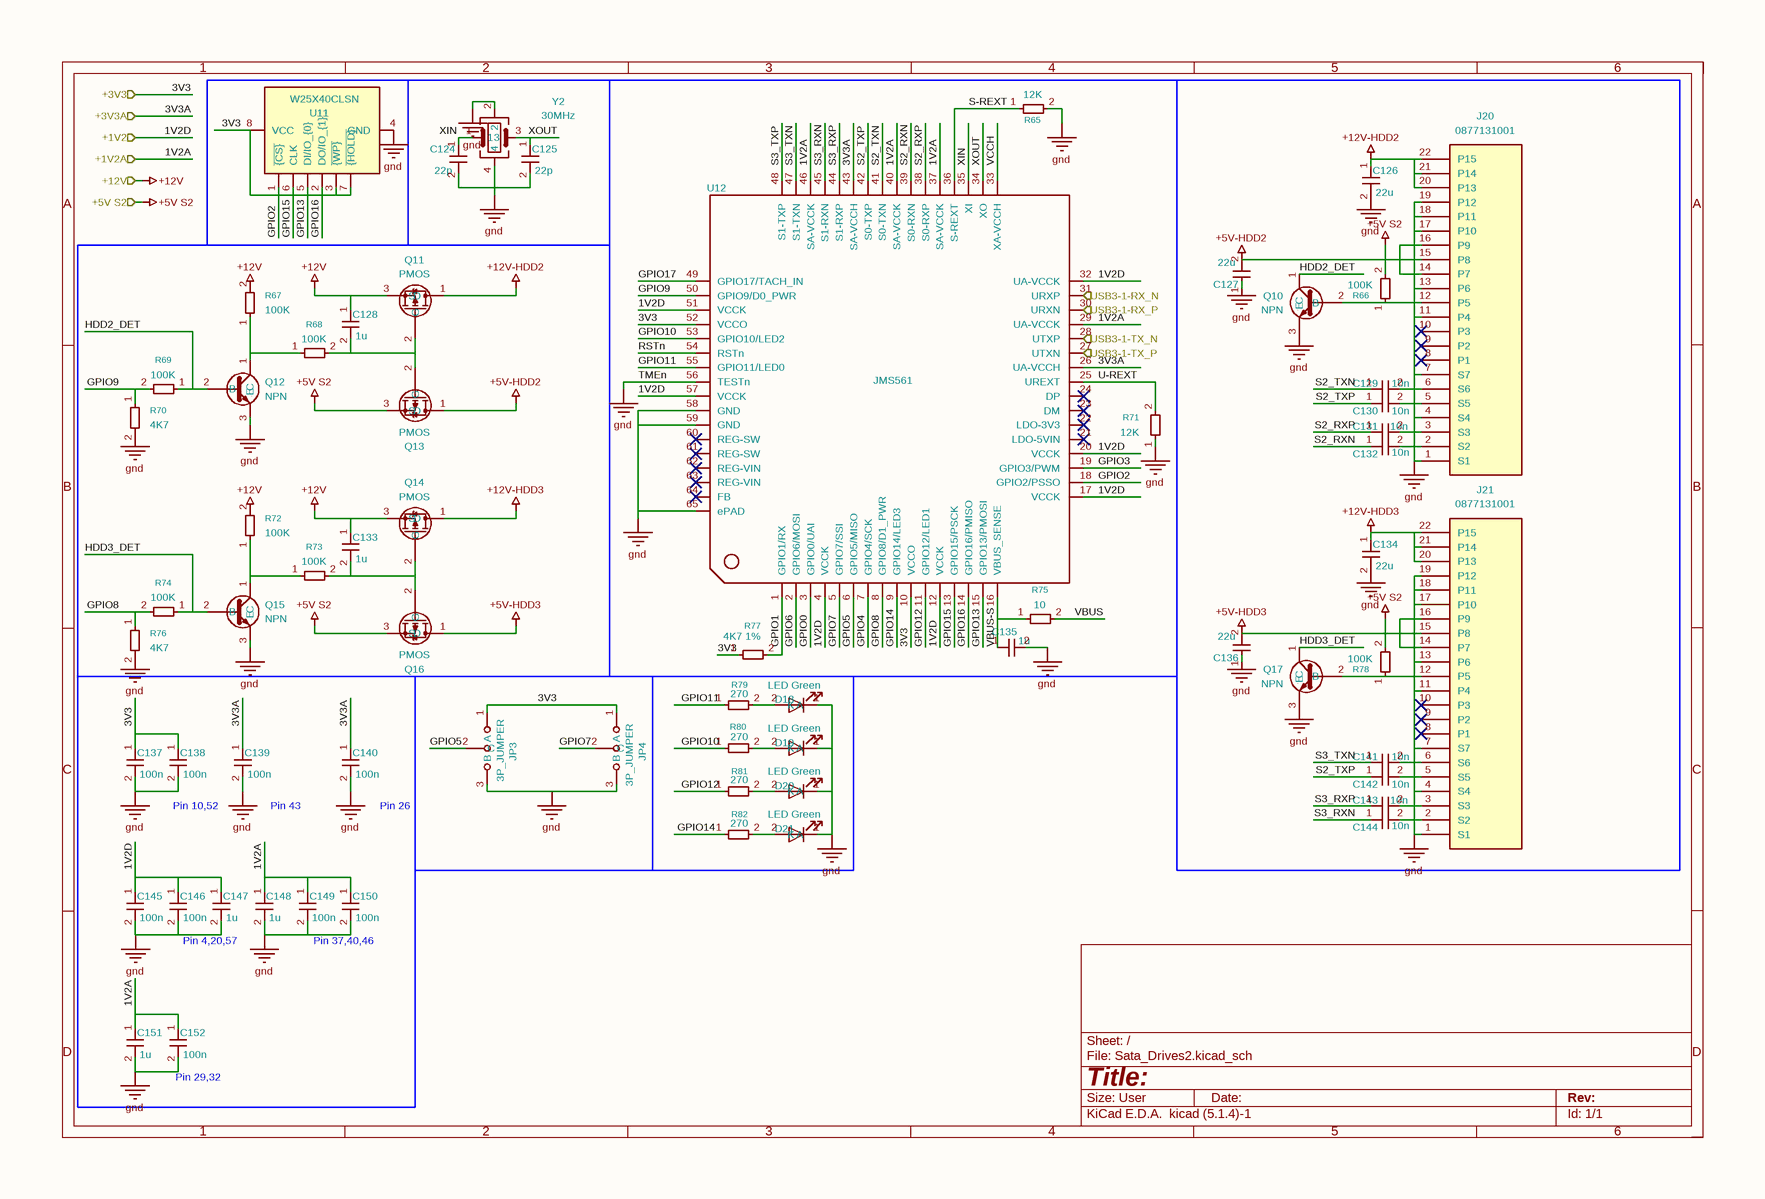
[diagram p7: Sata_Drives2.SchDoc]

### Parts
C124  22p  [C_0402_1005Metric]
C125  22p  [C_0402_1005Metric]
C126  22u  [C_1206_3216Metric]
C127  22u  [C_1206_3216Metric]
C128  1u  [C_0805_2012Metric]
C129  10n  [C_0402_1005Metric]
C130  10n  [C_0402_1005Metric]
C131  10n  [C_0402_1005Metric]
C132  10n  [C_0402_1005Metric]
C133  1u  [C_0805_2012Metric]
C134  22u  [C_1206_3216Metric]
C135  1u  [C_0603_1608Metric]
C136  22u  [C_1206_3216Metric]
C137  100n  [C_0603_1608Metric]
C138  100n  [C_0603_1608Metric]
C139  100n  [C_0603_1608Metric]
C140  100n  [C_0603_1608Metric]
C141  10n  [C_0402_1005Metric]
C142  10n  [C_0402_1005Metric]
C143  10n  [C_0402_1005Metric]
C144  10n  [C_0402_1005Metric]
C145  100n  [C_0603_1608Metric]
C146  100n  [C_0603_1608Metric]
C147  1u  [C_0805_2012Metric]
C148  1u  [C_0805_2012Metric]
C149  100n  [C_0603_1608Metric]
C150  100n  [C_0603_1608Metric]
C151  1u  [C_0805_2012Metric]
C152  100n  [C_0603_1608Metric]
D18  LED Green  [LED_0603_1608Metric]
D19  LED Green  [LED_0603_1608Metric]
D20  LED Green  [LED_0603_1608Metric]
D21  LED Green  [LED_0603_1608Metric]
J20  0877131001  [87713-1001]
J21  0877131001  [87713-1001]
JP3  3P_JUMPER  [PinHeader_1x03_P2.54mm_Vertical]
JP4  3P_JUMPER  [PinHeader_1x03_P2.54mm_Vertical]
Q10  NPN  [P200_SOT-23]
Q11  PMOS  [SOT95P237X117-3N]
Q12  NPN  [P200_SOT-23]
Q13  PMOS  [SOT95P237X117-3N]
Q14  PMOS  [SOT95P237X117-3N]
Q15  NPN  [P200_SOT-23]
Q16  PMOS  [SOT95P237X117-3N]
Q17  NPN  [P200_SOT-23]
R65  12K  [R_0603_1608Metric]
R66  100K  [R_0603_1608Metric]
R67  100K  [R_0603_1608Metric]
R68  100K  [R_0603_1608Metric]
R69  100K  [R_0603_1608Metric]
R70  4K7  [R_0603_1608Metric]
R71  12K  [R_0603_1608Metric]
R72  100K  [R_0603_1608Metric]
R73  100K  [R_0603_1608Metric]
R74  100K  [R_0603_1608Metric]
R75  10  [R_0603_1608Metric]
R76  4K7  [R_0603_1608Metric]
R77  4K7 1%  [R_0603_1608Metric]
R78  100K  [R_0603_1608Metric]
R79  270  [R_0603_1608Metric]
R80  270  [R_0603_1608Metric]
R81  270  [R_0603_1608Metric]
R82  270  [R_0603_1608Metric]
U11  W25X40CLSN  [SOIC-8_3.9x4.9mm_P1.27mm]
U12  JMS561  [QFN-64-1EP_8x8mm_P0.4mm_EP6.5x6.5mm_ThermalVias]
Y2  30MHz  [ABM810000MHZ12D2W]

### Ports
+1V2 (in), +1V2A (in), +3V3 (in), +3V3A (in), +5V S2 (in), +12V (in), USB3-1-RX_N (in), USB3-1-RX_P (in), USB3-1-TX_N (out), USB3-1-TX_P (out)

### Nets
1V2D: C145.1 C146.1 C147.1 U12.4(VCCK) U12.12(VCCK) U12.17(VCCK) U12.20(VCCK) U12.32(UA-VCCK) U12.51(VCCK) U12.57(VCCK) ; port +1V2  [project net +1V2]
3V3A: C139.1 C140.1 U12.26(UA-VCCH) U12.43(SA-VCCH) ; port +3V3A  [project net +3V3A]
+5V S2: Q13.3(S) Q16.3(S) R66.2 R78.2 ; port +5V S2
+5V-HDD2: C127.2 J20.14(P7) J20.15(P8) J20.16(P9) Q13.1(D)
+5V-HDD3: C136.2 J21.14(P7) J21.15(P8) J21.16(P9) Q16.1(D)
+12V: C128.1 C133.1 Q11.3(S) Q14.3(S) R67.2 R72.2 ; port +12V
+12V-HDD2: C126.1 J20.20(P13) J20.21(P14) J20.22(P15) Q11.1(D)
+12V-HDD3: C134.1 J21.20(P13) J21.21(P14) J21.22(P15) Q14.1(D)
GND: C124.2 C125.2 C126.2 C127.1 C134.2 C135.2 C136.1 C137.2 C138.2 C139.2 C140.2 C145.2 C146.2 C147.2 C148.2 C149.2 C150.2 C151.2 C152.2 D18.1(K) D19.1(K) D20.1(K) D21.1(K) J20.1(S1) J20.4(S4) J20.7(S7) J20.11(P4) J20.13(P6) J20.17(P10) J20.18(P11) J20.19(P12) J21.1(S1) J21.4(S4) J21.7(S7) J21.11(P4) J21.13(P6) J21.17(P10) J21.18(P11) J21.19(P12) JP3.3(B) JP4.3(B) Q10.3(E) Q12.3(E) Q15.3(E) Q17.3(E) R65.2 R70.2 R71.1 R76.2 U11.4(GND) U12.56(TESTn) U12.58(GND) U12.59(GND) U12.65(ePAD) Y2.2 Y2.4  [also labelled TMEn]
1V2A: C148.1 C149.1 C150.1 C151.1 C152.1 U12.29(UA-VCCK) U12.37(SA-VCCK) U12.40(SA-VCCK) U12.46(SA-VCCK) ; port +1V2A  [project net +1V2A]
3V3: C137.1 C138.1 JP3.1(A) JP4.1(A) R77.1 U11.3(~{{WP}}) U11.7(~{{HOLD}}) U11.8(VCC) U12.10(VCCO) U12.52(VCCO) ; port +3V3  [project net +3V3]
GPIO0: U12.3(GPIO0/UAI)
GPIO1: R77.2 U12.1(GPIO1/RX)
GPIO2: U11.1(~{{CS}}) U12.18(GPIO2/PSSO)
GPIO3: U12.19(GPIO3/PWM)
GPIO4: U12.7(GPIO4/SCK)
GPIO5: JP3.2(C) U12.6(GPIO5/MISO)
GPIO6: U12.2(GPIO6/MOSI)
GPIO7: JP4.2(C) U12.5(GPIO7/SSI)
GPIO8: R74.2 R76.1 U12.8(GPIO8/D1_PWR)
GPIO9: R69.2 R70.1 U12.50(GPIO9/D0_PWR)
GPIO10: R80.1 U12.53(GPIO10/LED2)
GPIO11: R79.1 U12.55(GPIO11/LED0)
GPIO12: R81.1 U12.11(GPIO12/LED1)
GPIO13: U11.5(DI/IO_{0}) U12.15(GPIO13/PMOSI)
GPIO14: R82.1 U12.9(GPIO14/LED3)
GPIO15: U11.6(CLK) U12.13(GPIO15/PSCK)
GPIO16: U11.2(DO/IO_{1}) U12.14(GPIO16/PMISO)
GPIO17: U12.49(GPIO17/TACH_IN)
HDD2_DET: Q10.1(C) Q12.2(B) R69.1
HDD3_DET: Q15.2(B) Q17.1(C) R74.1
RSTn: U12.54(RSTn)
S2_RXN: C132.1 U12.39(S0-RXN)
S2_RXP: C131.1 U12.38(S0-RXP)
S2_TXN: C129.1 U12.41(S0-TXN)
S2_TXP: C130.1 C142.1 U12.42(S0-TXP)
S3_RXN: C144.1 U12.45(S1-RXN)
S3_RXP: C143.1 U12.44(S1-RXP)
S3_TXN: C141.1 U12.47(S1-TXN)
S3_TXP: U12.48(S1-TXP)
S-REXT: R65.1 U12.36(S-REXT)
U-REXT: R71.2 U12.25(UREXT)
USB3-1-RX_N: U12.31(URXP) ; port USB3-1-RX_N
USB3-1-RX_P: U12.30(URXN) ; port USB3-1-RX_P
USB3-1-TX_N: U12.28(UTXP) ; port USB3-1-TX_N
USB3-1-TX_P: U12.27(UTXN) ; port USB3-1-TX_P
VBUS: R75.2
VBUS-S: C135.1 R75.1 U12.16(VBUS_SENSE)
VCCH: U12.33(XA-VCCH)
XIN: C124.1 U12.35(XI) Y2.1
XOUT: C125.1 U12.34(XO) Y2.3
NetC128_2: C128.2 Q11.2(G) Q13.2(G) R68.2
NetC129_2: C129.2 J20.6(S6)
NetC130_2: C130.2 J20.5(S5)
NetC131_2: C131.2 J20.3(S3)
NetC132_2: C132.2 J20.2(S2)
NetC133_2: C133.2 Q14.2(G) Q16.2(G) R73.2
NetC141_2: C141.2 J21.6(S6)
NetC142_2: C142.2 J21.5(S5)
NetC143_2: C143.2 J21.3(S3)
NetC144_2: C144.2 J21.2(S2)
NetD18_2: D18.2(A) R79.2
NetD19_2: D19.2(A) R80.2
NetD20_2: D20.2(A) R81.2
NetD21_2: D21.2(A) R82.2
NetJ20_12: J20.12(P5) Q10.2(B) R66.1
NetJ21_12: J21.12(P5) Q17.2(B) R78.1
NetQ12_1: Q12.1(C) R67.1 R68.1
NetQ15_1: Q15.1(C) R72.1 R73.1

Not connected (* = marked no-connect by the designer): J20 8(P1)* 9(P2)* 10(P3)*; J21 8(P1)* 9(P2)* 10(P3)*; U12 21(LDO-5VIN)* 22(LDO-3V3)* 23(DM)* 24(DP)* 60(REG-SW)* 61(REG-SW)* 62(REG-VIN)* 63(REG-VIN)* 64(FB)*

### Notes on the sheet
- Pin 10,52
- Pin 43
- Pin 26
- Pin 4,20,57
- Pin 37,40,46
- (near C152) Pin 29,32
- 1
- 2
- 3
- 4
- 5
- 6
- A
- B
- C
- D
- Title:
- File: Sata_Drives2.kicad_sch
- Sheet: /
- KiCad E.D.A.  kicad (5.1.4)-1
- Size: User
- Date:
- Rev:
- Id: 1/1

### Library data of the parts
C124-C152 = C_Small: as C77 on sheet Drives_M.2
  C124 C125: Value: 22p; Footprint: Capacitor_SMD:C_0402_1005Metric
  C126 C127 C134 C136: Value: 22u; Footprint: Capacitor_SMD:C_1206_3216Metric
  C128 C133 C147 C148 C151: Value: 1u; Footprint: Capacitor_SMD:C_0805_2012Metric
  C129-C132 C141-C144: Value: 10n; Footprint: Capacitor_SMD:C_0402_1005Metric
  C135: Value: 1u; Footprint: Capacitor_SMD:C_0603_1608Metric
  C137-C140 C145 C146 C149 C150 C152: Value: 100n; Footprint: Capacitor_SMD:C_0603_1608Metric
D18-D21 = LED: as D10 on sheet Drives_M.2; Value: LED Green; Footprint: LED_SMD:LED_0603_1608Metric
J20 J21 = 0877131001: Manufacturer_Name: Molex; Description: CONN RCPT 22POS STR .05" SMD AU; Manufacturer_Part_Number: 0877131001; Mouser Part Number: N/A; Mouser Price/Stock: https://www.mouser.co.uk/ProductDetail/Molex/0877131001?qs=PBcRNPEHKspplW%252BmhlTGqA%3D%3D; Arrow Part Number: 0877131001; Arrow Price/Stock: https://www.arrow.com/en/products/0877131001/molex?region=nac; Value: 0877131001; Footprint: 87713-1001:87713-1001
JP3 JP4 = Jumper_3_Bridged12: Description: Jumper, 3-pole, pins 1+2 closed/bridged; Value: 3P_JUMPER; Footprint: Connector_PinHeader_2.54mm:PinHeader_1x03_P2.54mm_Vertical
Q10 Q12 Q15 Q17 = NPN: Description: Bipolar transistor symbol for simulation only, substrate tied to the emitter; Sim.Type: GUMMELPOON; Sim.Pins: 1=C 2=B 3=E; Sim.Device: NPN; Value: NPN; Footprint: MMBT3904:P200_SOT-23
Q11 Q13 Q14 Q16 = PMOS: Description: P-MOSFET transistor, drain/source/gate; Sim.Type: VDMOS; Sim.Pins: 1=D 2=G 3=S; Sim.Device: PMOS; Value: PMOS; Footprint: AOSS21311C:SOT95P237X117-3N
R65-R82 = R_Small: Description: Resistor, small symbol; Footprint: Resistor_SMD:R_0603_1608Metric
  R65 R71: Value: 12K
  R66-R69 R72-R74 R78: Value: 100K
  R70 R76: Value: 4K7
  R75: Value: 10
  R77: Value: 4K7 1%
  R79-R82: Value: 270
U11 = W25X40CLSN: Description: 4Mbit / 512KiB Serial Flash memory, Standard/Dual I/O SPI, 2.3-3.6V, SOIC-8 (150 mil); Value: W25X40CLSN; Footprint: Package_SO:SOIC-8_3.9x4.9mm_P1.27mm
U12 = JMS561: Description: JMS561 is a SuperSpeed USB 5Gb/s to dual SATA 6Gb/s bridge controller, which also supports various application configurations.; Value: JMS561; Footprint: Package_DFN_QFN:QFN-64-1EP_8x8mm_P0.4mm_EP6.5x6.5mm_ThermalVias
Y2 = Crystal_GND24: Description: Four pin crystal, GND on pins 2 and 4; Value: 30MHz; Footprint: ABM8-30.000MHZ-B2-T:ABM810000MHZ12D2W

## Sheet Power.SchDoc
size 297 x 209 mm
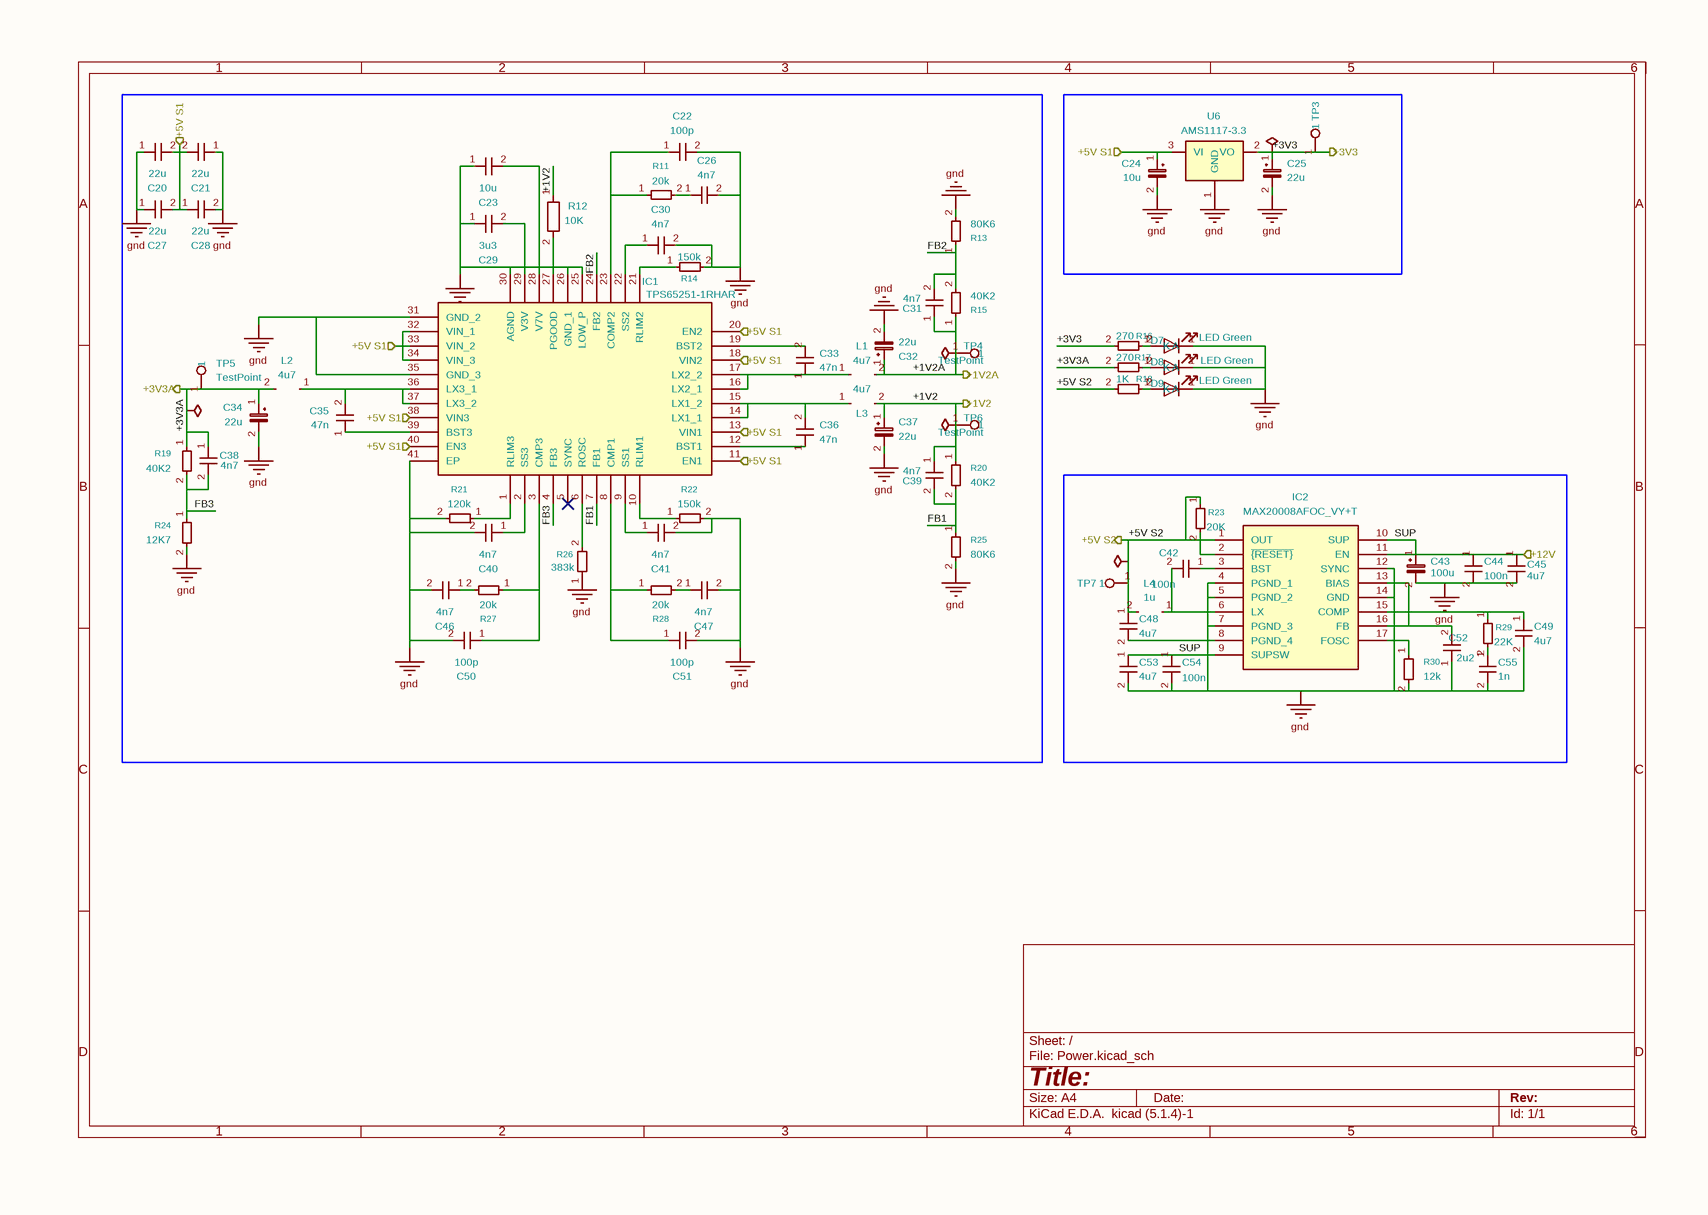
[diagram p8: Power.SchDoc]

### Parts
#FLG04  PWR_FLAG  (value not drawn)  (graphical)
#FLG05  PWR_FLAG  (value not drawn)  (graphical)
#FLG06  PWR_FLAG  (value not drawn)  (graphical)
#FLG07  PWR_FLAG  (value not drawn)  (graphical)
#FLG08  PWR_FLAG  (value not drawn)  (graphical)
C20  22u  [C_0805_2012Metric]
C21  22u  [C_0805_2012Metric]
C22  100p  [C_0402_1005Metric]
C23  10u  [C_0603_1608Metric]
C24  10u  [CAP_EEEFK1H100UR]
C25  22u  [CAP_EEEFK1A220AR]
C26  4n7  [C_0402_1005Metric]
C27  22u  [C_0805_2012Metric]
C28  22u  [C_0805_2012Metric]
C29  3u3  [C_0603_1608Metric]
C30  4n7  [C_0402_1005Metric]
C31  4n7  [C_0402_1005Metric]
C32  22u  [CAP_EEEFK1A220AR]
C33  47n  [C_0402_1005Metric]
C34  22u  [CAP_EEEFK1A220AR]
C35  47n  [C_0402_1005Metric]
C36  47n  [C_0402_1005Metric]
C37  22u  [CAP_EEEFK1A220AR]
C38  4n7  [C_0402_1005Metric]
C39  4n7  [C_0402_1005Metric]
C40  4n7  [C_0402_1005Metric]
C41  4n7  [C_0402_1005Metric]
C42  100n  [C_0603_1608Metric]
C43  100u  [CAP_EEEFTH101XAP]
C44  100n  [C_0402_1005Metric]
C45  4u7  [C_0805_2012Metric]
C46  4n7  [C_0402_1005Metric]
C47  4n7  [C_0402_1005Metric]
C48  4u7  [C_0805_2012Metric]
C49  4u7  [C_0402_1005Metric]
C50  100p  [C_0402_1005Metric]
C51  100p  [C_0402_1005Metric]
C52  2u2  [C_0402_1005Metric]
C53  4u7  [C_0402_1005Metric]
C54  100n  [C_0603_1608Metric]
C55  1n  [C_0402_1005Metric]
D7  LED Green  [LED_0603_1608Metric]
D8  LED Green  [LED_0603_1608Metric]
D9  LED Green  [LED_0603_1608Metric]
IC1  TPS65251-1RHAR  [VQFN-40-1EP_6x6mm_P0.5mm_EP3.5x3.5mm_ThermalVias]
IC2  MAX20008AFOC_VY+T  [MAX20008AFOCVYT]
L1  4u7  [INDPM5050X400N]
L2  4u7  [INDPM5050X400N]
L3  4u7  [INDPM5050X400N]
L4  1u  [SRN5040TA1R0M]
R11  20k  [R_0402_1005Metric]
R12  10K  [R_0603_1608Metric]
R13  80K6  [R_0402_1005Metric]
R14  150k  [R_0402_1005Metric]
R15  40K2  [R_0402_1005Metric]
R16  270  [R_0603_1608Metric]
R17  270  [R_0603_1608Metric]
R18  1K  [R_0603_1608Metric]
R19  40K2  [R_0402_1005Metric]
R20  40K2  [R_0402_1005Metric]
R21  120k  [R_0603_1608Metric]
R22  150k  [R_0603_1608Metric]
R23  20K  [R_0603_1608Metric]
R24  12K7  [R_0402_1005Metric]
R25  80K6  [R_0402_1005Metric]
R26  383k  [R_0402_1005Metric]
R27  20k  [R_0603_1608Metric]
R28  20k  [R_0603_1608Metric]
R29  22K  [C_0402_1005Metric]
R30  12k  [R_0603_1608Metric]
TP3  TestPoint  [TestPoint_Pad_1.0x1.0mm]  (value not drawn)
TP4  TestPoint  [TestPoint_Pad_1.0x1.0mm]
TP5  TestPoint  [TestPoint_Pad_1.0x1.0mm]
TP6  TestPoint  [TestPoint_Pad_1.0x1.0mm]
TP7  TestPoint  [TestPoint_Pad_1.0x1.0mm]  (value not drawn)
U6  AMS1117-3.3  [SOT-223-3_TabPin2]

### Ports
+1V2 (out), +1V2A (out), +3V3 (out), +3V3A (out), +5V S1 (in), +5V S2 (out), +12V (in)

### Nets
+1V2: #FLG07.1 C37.1 C39.1 L3.2 R12.1 R20.1 TP6.1 ; port +1V2
+3V3A: #FLG06.1 C34.1 C38.1 L2.2 R17.2 R19.1 TP5.1 ; port +3V3A
+5V S2: #FLG08.1 C48.1 IC2.1(OUT) L4.2 R18.2 R23.1 TP7.1 ; port +5V S2
GND: C20.1 C21.1 C22.2 C23.1 C24.2 C25.2 C26.2 C27.1 C28.2 C29.1 C30.2 C32.2 C34.2 C37.2 C40.2 C41.2 C43.2 C44.2 C45.2 C46.2 C47.2 C48.2 C49.2 C50.2 C51.2 C52.1 C53.2 C54.2 C55.2 D7.1(K) D8.1(K) D9.1(K) IC1.25(LOW_P) IC1.26(GND_1) IC1.30(AGND) IC1.31(GND_2) IC1.35(GND_3) IC1.41(EP) IC2.4(PGND_1) IC2.5(PGND_2) IC2.7(PGND_3) IC2.8(PGND_4) IC2.12(SYNC) IC2.14(GND) R13.2 R14.2 R21.2 R22.2 R24.2 R25.2 R26.1 R30.2 U6.1(GND)
SUP: C43.1 C44.1 C45.1 C53.1 C54.1 IC2.9(SUPSW) IC2.10(SUP) IC2.11(EN) ; port +12V  [project net +12V]
+1V2A: #FLG05.1 C31.1 C32.1 L1.2 R15.1 TP4.1 ; port +1V2A
+3V3: #FLG04.1 C25.1 R16.2 TP3.1 U6.2(VO) ; port +3V3
+5V: C20.2 C21.2 C24.1 C27.2 C28.1 IC1.11(EN1) IC1.13(VIN1) IC1.18(VIN2) IC1.20(EN2) IC1.32(VIN_1) IC1.33(VIN_2) IC1.34(VIN_3) IC1.38(VIN3) IC1.40(EN3) U6.3(VI) ; port +5V S1
FB1: C39.2 IC1.7(FB1) R20.2 R25.1
FB2: C31.2 IC1.24(FB2) R13.1 R15.2
FB3: C38.2 IC1.4(FB3) R19.2 R24.1
NetC22_1: C22.1 IC1.23(COMP2) R11.1
NetC23_2: C23.2 IC1.28(V7V)
NetC26_1: C26.1 R11.2
NetC29_2: C29.2 IC1.29(V3V)
NetC30_1: C30.1 IC1.22(SS2)
NetC33_1: C33.1 IC1.16(LX2_1) IC1.17(LX2_2) L1.1
NetC33_2: C33.2 IC1.19(BST2)
NetC35_1: C35.1 IC1.39(BST3)
NetC35_2: C35.2 IC1.36(LX3_1) IC1.37(LX3_2) L2.1
NetC36_1: C36.1 IC1.12(BST1)
NetC36_2: C36.2 IC1.14(LX1_1) IC1.15(LX1_2) L3.1
NetC40_1: C40.1 IC1.2(SS3)
NetC41_1: C41.1 IC1.9(SS1)
NetC42_1: C42.1 IC2.3(BST)
NetC42_2: C42.2 IC2.6(LX) L4.1
NetC46_1: C46.1 R27.2
NetC47_1: C47.1 R28.2
NetC49_1: C49.1 IC2.15(COMP) R29.1
NetC50_1: C50.1 IC1.3(CMP3) R27.1
NetC51_1: C51.1 IC1.8(CMP1) R28.1
NetC52_2: C52.2 IC2.13(BIAS) IC2.16(FB)
NetC55_1: C55.1 R29.2
NetD7_2: D7.2(A) R16.1
NetD8_2: D8.2(A) R17.1
NetD9_2: D9.2(A) R18.1
NetIC1_1: IC1.1(RLIM3) R21.1
NetIC1_6: IC1.6(ROSC) R26.2
NetIC1_10: IC1.10(RLIM1) R22.1
NetIC1_21: IC1.21(RLIM2) R14.1
NetIC1_27: IC1.27(PGOOD) R12.2
NetIC2_2: IC2.2(~{{RESET}}) R23.2
NetIC2_17: IC2.17(FOSC) R30.1

Not connected (* = marked no-connect by the designer): IC1 5(SYNC)*

### Notes on the sheet
- 1
- 2
- 3
- 4
- 5
- 6
- A
- B
- C
- D
- Title:
- File: Power.kicad_sch
- Sheet: /
- KiCad E.D.A.  kicad (5.1.4)-1
- Size: A4
- Date:
- Rev:
- Id: 1/1

### Library data of the parts
#FLG04 #FLG05 #FLG06 #FLG07 #FLG08 = PWR_FLAG: as #FLG09 on sheet Drives_M.2; Value: PWR_FLAG
C20-C23 C26-C31 C33 C35 C36 C38-C42 C44-C55 = C_Small: as C77 on sheet Drives_M.2
  C20 C21 C27 C28: Value: 22u; Footprint: Capacitor_SMD:C_0805_2012Metric
  C22 C50 C51: Value: 100p; Footprint: Capacitor_SMD:C_0402_1005Metric
  C23: Value: 10u; Footprint: Capacitor_SMD:C_0603_1608Metric
  C26 C30 C31 C38-C41 C46 C47: Value: 4n7; Footprint: Capacitor_SMD:C_0402_1005Metric
  C29: Value: 3u3; Footprint: Capacitor_SMD:C_0603_1608Metric
  C33 C35 C36: Value: 47n; Footprint: Capacitor_SMD:C_0402_1005Metric
  C42 C54: Value: 100n; Footprint: Capacitor_SMD:C_0603_1608Metric
  C44: Value: 100n; Footprint: Capacitor_SMD:C_0402_1005Metric
  C45 C48: Value: 4u7; Footprint: Capacitor_SMD:C_0805_2012Metric
  C49 C53: Value: 4u7; Footprint: Capacitor_SMD:C_0402_1005Metric
  C52: Value: 2u2; Footprint: Capacitor_SMD:C_0402_1005Metric
  C55: Value: 1n; Footprint: Capacitor_SMD:C_0402_1005Metric
C24 C25 C32 C34 C37 C43 = C_Polarized_Small: Description: Polarized capacitor, small symbol
  C24: Value: 10u; Footprint: EEEFK1H100UR:CAP_EEEFK1H100UR
  C25 C32 C34 C37: Value: 22u; Footprint: EEEFK1A220AR:CAP_EEEFK1A220AR
  C43: Value: 100u; Footprint: EEE_FTH101XAP:CAP_EEEFTH101XAP
D7-D9 = LED: as D10 on sheet Drives_M.2; Value: LED Green; Footprint: LED_SMD:LED_0603_1608Metric
IC1 = TPS65251-1RHAR: Manufacturer_Name: Texas Instruments; Description: 4.5-V to 18-V input, 3A/2A/2A output, Synchronous triple buck converter; Height: 1; Manufacturer_Part_Number: TPS65251-1RHAR; Mouser Part Number: 595-TPS65251-1RHAR; Mouser Price/Stock: https://www.mouser.co.uk/ProductDetail/Texas-Instruments/TPS65251-1RHAR?qs=JRStGrVgRuSy8em9PUe0zA%3D%3D; Arrow Part Number: TPS65251-1RHAR; Arrow Price/Stock: https://www.arrow.com/en/products/tps65251-1rhar/texas-instruments?region=nac; Value: TPS65251-1RHAR; Footprint: Package_DFN_QFN:VQFN-40-1EP_6x6mm_P0.5mm_EP3.5x3.5mm_ThermalVias
IC2 = MAX20008AFOC_VY+T: Manufacturer_Name: Analog Devices; Manufacturer_Part_Number: MAX20008AFOC/VY+T; Description: Switching Voltage Regulators 36V, 220kHz to 2.2MHz, 4A/6A/8A Fully integrated step down converter; Height: 0.75; Mouser Part Number: 700-MAX20008AFOC/VYT; Mouser Price/Stock: https://www.mouser.co.uk/ProductDetail/Analog-Devices-Maxim-Integrated/MAX20008AFOC-VY%2bT?qs=vLWxofP3U2wvQQR8GkDmgw%3D%3D; Arrow Part Number: MAX20008AFOC/VY+T; Arrow Price/Stock: https://www.arrow.com/en/products/max20008afocvyt/maxim-integrated?region=nac; Value: MAX20008AFOC_VY+T; Footprint: MAX20008AFOC_VY+T:MAX20008AFOCVYT
L1-L4 = L_Small: Description: Inductor, small symbol
  L1-L3: Value: 4u7; Footprint: SRN5040-4R7M:INDPM5050X400N
  L4: Value: 1u; Footprint: SRN5040TA-1R0M:SRN5040TA1R0M
R11 R13-R30 = R_Small: Description: Resistor, small symbol
  R11: Value: 20k; Footprint: Resistor_SMD:R_0402_1005Metric
  R13 R25: Value: 80K6; Footprint: Resistor_SMD:R_0402_1005Metric
  R14: Value: 150k; Footprint: Resistor_SMD:R_0402_1005Metric
  R15 R19 R20: Value: 40K2; Footprint: Resistor_SMD:R_0402_1005Metric
  R16 R17: Value: 270; Footprint: Resistor_SMD:R_0603_1608Metric
  R18: Value: 1K; Footprint: Resistor_SMD:R_0603_1608Metric
  R21: Value: 120k; Footprint: Resistor_SMD:R_0603_1608Metric
  R22: Value: 150k; Footprint: Resistor_SMD:R_0603_1608Metric
  R23: Value: 20K; Footprint: Resistor_SMD:R_0603_1608Metric
  R24: Value: 12K7; Footprint: Resistor_SMD:R_0402_1005Metric
  R26: Value: 383k; Footprint: Resistor_SMD:R_0402_1005Metric
  R27 R28: Value: 20k; Footprint: Resistor_SMD:R_0603_1608Metric
  R29: Value: 22K; Footprint: Capacitor_SMD:C_0402_1005Metric
  R30: Value: 12k; Footprint: Resistor_SMD:R_0603_1608Metric
R12 = R: Value: 10K; Footprint: Resistor_SMD:R_0603_1608Metric
U6 = AMS1117-3.3: Description: 1A Low Dropout regulator, positive, 3.3V fixed output, SOT-223; Value: AMS1117-3.3; Footprint: Package_TO_SOT_SMD:SOT-223-3_TabPin2
TP3-TP7 = TestPoint: Description: test point; Value: TestPoint; Footprint: TestPoint:TestPoint_Pad_1.0x1.0mm

## Sheet USB & Ethernet.SchDoc
size 219 x 209 mm
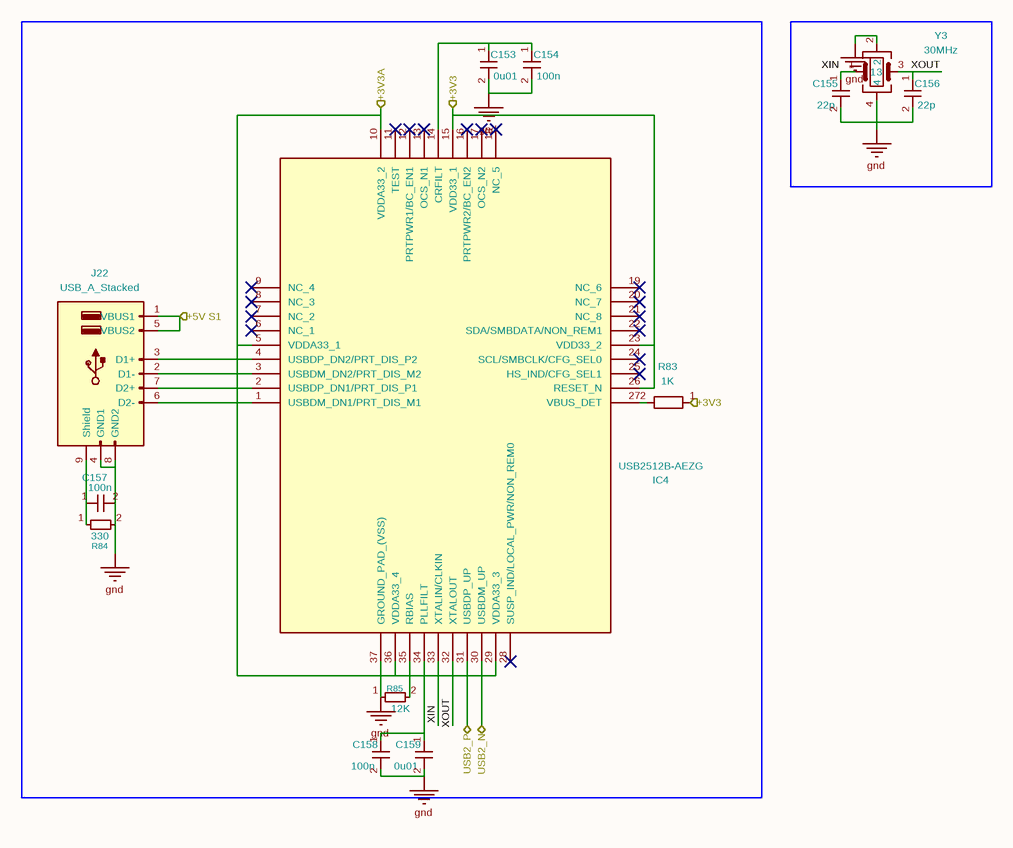
[diagram p9: USB & Ethernet.SchDoc]

### Parts
C153  0u01  [C_0402_1005Metric]
C154  100n  [C_0603_1608Metric]
C155  22p  [C_0402_1005Metric]
C156  22p  [C_0402_1005Metric]
C157  100n  [C_0603_1608Metric]
C158  100n  [C_0603_1608Metric]
C159  0u01  [C_0402_1005Metric]
IC4  USB2512B-AEZG  [QFN50P600X600X100-37N-D]
J22  USB_A_Stacked  [USB_A_Wuerth_61400826021_Horizontal_Stacked]
R83  1K  [R_0603_1608Metric]
R84  330  [R_0603_1608Metric]
R85  12K  [R_0603_1608Metric]
Y3  30MHz  [ABM810000MHZ12D2W]

### Ports
+3V3 (in), +3V3A (in), +5V S1 (in), USB2_N (bidir), USB2_P (bidir)

### Nets
+3V3A: IC4.5(VDDA33_1) IC4.10(VDDA33_2) IC4.29(VDDA33_3) IC4.36(VDDA33_4) ; port +3V3A
GND: C153.2 C154.2 C155.2 C156.2 C157.2 C158.2 C159.2 IC4.37(GROUND_PAD_(VSS)) J22.4(GND1) J22.8(GND2) R84.2 R85.1 Y3.2 Y3.4
+3V3: IC4.15(VDD33_1) IC4.23(VDD33_2) IC4.26(RESET_N) R83.1 ; port +3V3
+5V: J22.1(VBUS1) J22.5(VBUS2) ; port +5V S1
USB2_N: IC4.30(USBDM_UP) ; port USB2_N
USB2_P: IC4.31(USBDP_UP) ; port USB2_P
XIN: C155.1 IC4.33(XTALIN/CLKIN) Y3.1
XOUT: C156.1 IC4.32(XTALOUT) Y3.3
NetC153_1: C153.1 C154.1 IC4.14(CRFILT)
NetC157_1: C157.1 J22.9(Shield) R84.1
NetC158_1: C158.1 C159.1 IC4.34(PLLFILT)
NetIC4_1: IC4.1(USBDM_DN1/PRT_DIS_M1) J22.6(D2-)
NetIC4_2: IC4.2(USBDP_DN1/PRT_DIS_P1) J22.7(D2+)
NetIC4_3: IC4.3(USBDM_DN2/PRT_DIS_M2) J22.2(D1-)
NetIC4_4: IC4.4(USBDP_DN2/PRT_DIS_P2) J22.3(D1+)
NetIC4_27: IC4.27(VBUS_DET) R83.2
NetIC4_35: IC4.35(RBIAS) R85.2

Not connected (* = marked no-connect by the designer): IC4 6(NC_1)* 7(NC_2)* 8(NC_3)* 9(NC_4)* 11(TEST)* 12(PRTPWR1/BC_EN1)* 13(OCS_N1)* 16(PRTPWR2/BC_EN2)* 17(OCS_N2)* 18(NC_5)* 19(NC_6)* 20(NC_7)* 21(NC_8)* 22(SDA/SMBDATA/NON_REM1)* 24(SCL/SMBCLK/CFG_SEL0)* 25(HS_IND/CFG_SEL1)* 28(SUSP_IND/LOCAL_PWR/NON_REM0)*

### Notes on the sheet
- 1
- 2
- 3
- 4
- A
- B
- C
- D
- Title:
- File: USB & Ethernet.kicad_sch
- Sheet: /
- KiCad E.D.A.  kicad (5.1.4)-1
- Size: User
- Date:
- Rev:
- Id: 1/1

### Library data of the parts
C153-C159 = C_Small: as C77 on sheet Drives_M.2
  C153 C159: Value: 0u01; Footprint: Capacitor_SMD:C_0402_1005Metric
  C154 C157 C158: Value: 100n; Footprint: Capacitor_SMD:C_0603_1608Metric
  C155 C156: Value: 22p; Footprint: Capacitor_SMD:C_0402_1005Metric
IC4 = USB2512B-AEZG: Manufacturer_Name: Microchip; Description: USB 2.0 Hub Controller 2-Port BC QFN36 Microchip USB2512B-AEZG, USB Controller, 480MBps, USB 2.0, 3.3 V, 36-Pin QFN; Height: 1; Manufacturer_Part_Number: USB2512B-AEZG; Mouser Part Number: 886-USB2512B-AEZG; Mouser Price/Stock: https://www.mouser.co.uk/ProductDetail/Microchip-Technology/USB2512B-AEZG?qs=pA5MXup5wxGNvJiLqKVEsA%3D%3D; Arrow Part Number: USB2512B-AEZG; Arrow Price/Stock: https://www.arrow.com/en/products/usb2512b-aezg/microchip-technology?region=nac; Value: USB2512B-AEZG; Footprint: USB2512B-AEZG:QFN50P600X600X100-37N-D
J22 = USB_A_Stacked: Description: USB Type A connector, stacked; Value: USB_A_Stacked; Footprint: Connector_USB:USB_A_Wuerth_61400826021_Horizontal_Stacked
R83 = R: Description: Resistor; Value: 1K; Footprint: Resistor_SMD:R_0603_1608Metric
R84 R85 = R_Small: Description: Resistor, small symbol; Footprint: Resistor_SMD:R_0603_1608Metric
  R84: Value: 330
  R85: Value: 12K
Y3 = Crystal_GND24: as Y2 on sheet Sata_Drives2; Value: 30MHz; Footprint: ABM8-30.000MHZ-B2-T:ABM810000MHZ12D2W

## Sheet Section A - Title A.SchDoc
size 299 x 229 mm
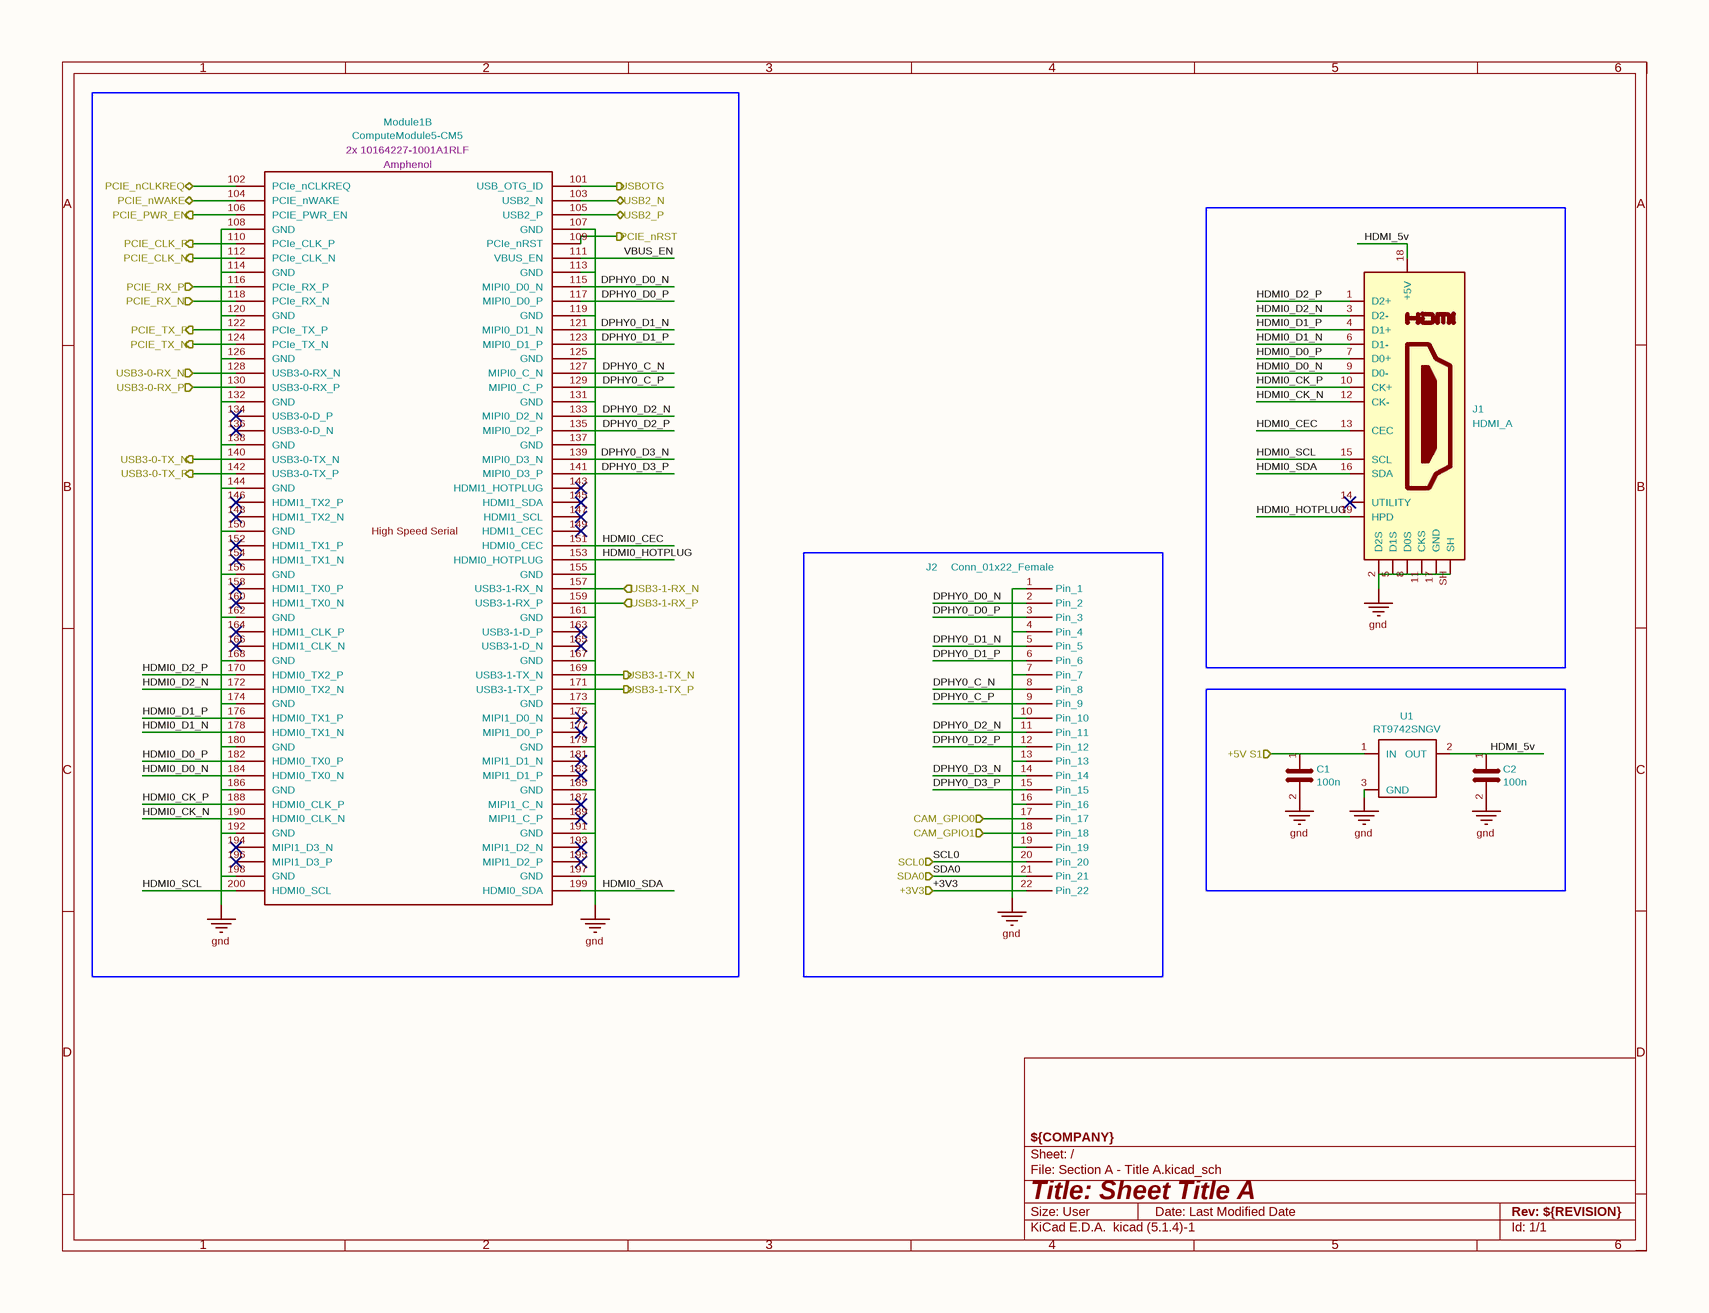
[diagram p10: Section A - Title A.SchDoc]

### Parts
C1  100n  [C_0603_1608Metric]
C2  100n  [C_0603_1608Metric]
J1  HDMI_A  [AMPHENOL_10029449-111RLF]
J2  Conn_01x22_Female  [Hirose_FH12-22S-0.5SH_1x22-1MP_P0.50mm_Horizontal]
Module1  Field4: Amphenol  Field5: 2x 10164227-1001A1RLF  [Raspberry-Pi-5-Compute-Module]  (hidden comment: ComputeModule5-CM5)  (part B of 2)
U1  RT9742SNGV  [TSOT-23_HandSoldering]

### Ports
+3V3 (in), +5V S1 (in), CAM_GPIO0 (in), CAM_GPIO1 (in), PCIE_CLK_N (out), PCIE_CLK_P (out), PCIE_nCLKREQ (bidir), PCIE_nRST (out), PCIE_nWAKE (bidir), PCIE_PWR_EN (out), PCIE_RX_N (in), PCIE_RX_P (in), PCIE_TX_N (out), PCIE_TX_P (out), SCL0 (in), SDA0 (in), USB2_N (bidir), USB2_P (bidir), USB3-0-RX_N (in), USB3-0-RX_P (in), USB3-0-TX_N (out), USB3-0-TX_P (out), USB3-1-RX_N (in), USB3-1-RX_P (in), USB3-1-TX_N (out), USB3-1-TX_P (out), USBOTG (out)

### Nets
GND: C1.2 C2.2 J1.2(D2S) J1.5(D1S) J1.8(D0S) J1.11(CKS) J1.17(GND) J1.SH J2.1(Pin_1) J2.4(Pin_4) J2.7(Pin_7) J2.10(Pin_10) J2.13(Pin_13) J2.16(Pin_16) J2.19(Pin_19) Module1.107(GND) Module1.108(GND) Module1.113(GND) Module1.114(GND) Module1.119(GND) Module1.120(GND) Module1.125(GND) Module1.126(GND) Module1.131(GND) Module1.132(GND) Module1.137(GND) Module1.138(GND) Module1.144(GND) Module1.150(GND) Module1.155(GND) Module1.156(GND) Module1.161(GND) Module1.162(GND) Module1.167(GND) Module1.168(GND) Module1.173(GND) Module1.174(GND) Module1.179(GND) Module1.180(GND) Module1.185(GND) Module1.186(GND) Module1.191(GND) Module1.192(GND) Module1.197(GND) Module1.198(GND) U1.3(GND)
+3V3: J2.22(Pin_22) ; port +3V3
+5V: C1.1 U1.1(IN) ; port +5V S1
CAM_GPIO0: J2.17(Pin_17) ; port CAM_GPIO0
CAM_GPIO1: J2.18(Pin_18) ; port CAM_GPIO1
DPHY0_C_N: J2.8(Pin_8) Module1.127(MIPI0_C_N)
DPHY0_C_P: J2.9(Pin_9) Module1.129(MIPI0_C_P)
DPHY0_D0_N: J2.2(Pin_2) Module1.115(MIPI0_D0_N)
DPHY0_D0_P: J2.3(Pin_3) Module1.117(MIPI0_D0_P)
DPHY0_D1_N: J2.5(Pin_5) Module1.121(MIPI0_D1_N)
DPHY0_D1_P: J2.6(Pin_6) Module1.123(MIPI0_D1_P)
DPHY0_D2_N: J2.11(Pin_11) Module1.133(MIPI0_D2_N)
DPHY0_D2_P: J2.12(Pin_12) Module1.135(MIPI0_D2_P)
DPHY0_D3_N: J2.14(Pin_14) Module1.139(MIPI0_D3_N)
DPHY0_D3_P: J2.15(Pin_15) Module1.141(MIPI0_D3_P)
EN: Module1.106(PCIE_PWR_EN) ; port PCIE_PWR_EN
HDMI0_CEC: J1.13(CEC) Module1.151(HDMI0_CEC)
HDMI0_CK_N: J1.12(CK-) Module1.190(HDMI0_CLK_N)
HDMI0_CK_P: J1.10(CK+) Module1.188(HDMI0_CLK_P)
HDMI0_D0_N: J1.9(D0-) Module1.184(HDMI0_TX0_N)
HDMI0_D0_P: J1.7(D0+) Module1.182(HDMI0_TX0_P)
HDMI0_D1_N: J1.6(D1-) Module1.178(HDMI0_TX1_N)
HDMI0_D1_P: J1.4(D1+) Module1.176(HDMI0_TX1_P)
HDMI0_D2_N: J1.3(D2-) Module1.172(HDMI0_TX2_N)
HDMI0_D2_P: J1.1(D2+) Module1.170(HDMI0_TX2_P)
HDMI0_HOTPLUG: J1.19(HPD) Module1.153(HDMI0_HOTPLUG)
HDMI0_SCL: J1.15(SCL) Module1.200(HDMI0_SCL)
HDMI0_SDA: J1.16(SDA) Module1.199(HDMI0_SDA)
HDMI_5v: C2.1 J1.18(+5V) U1.2(OUT)
PCIE_CLK_N: Module1.112(PCIe_CLK_N) ; port PCIE_CLK_N
PCIE_CLK_P: Module1.110(PCIe_CLK_P) ; port PCIE_CLK_P
PCIE_nCLKREQ: Module1.102(PCIe_nCLKREQ) ; port PCIE_nCLKREQ
PCIE_nRST: Module1.109(PCIe_nRST) ; port PCIE_nRST
PCIE_nWAKE: Module1.104(PCIE_nWAKE) ; port PCIE_nWAKE
PCIE_RX_N: Module1.118(PCIe_RX_N) ; port PCIE_RX_N
PCIE_RX_P: Module1.116(PCIe_RX_P) ; port PCIE_RX_P
PCIE_TX_N: Module1.124(PCIe_TX_N) ; port PCIE_TX_N
PCIE_TX_P: Module1.122(PCIe_TX_P) ; port PCIE_TX_P
SCL0: J2.20(Pin_20) ; port SCL0
SDA0: J2.21(Pin_21) ; port SDA0
USB2_N: Module1.103(USB2_N) ; port USB2_N
USB2_P: Module1.105(USB2_P) ; port USB2_P
USB3-0-RX_N: Module1.128(USB3-0-RX_N) ; port USB3-0-RX_N
USB3-0-RX_P: Module1.130(USB3-0-RX_P) ; port USB3-0-RX_P
USB3-0-TX_N: Module1.140(USB3-0-TX_N) ; port USB3-0-TX_N
USB3-0-TX_P: Module1.142(USB3-0-TX_P) ; port USB3-0-TX_P
USB3-1-RX_N: Module1.157(USB3-1-RX_N) ; port USB3-1-RX_N
USB3-1-RX_P: Module1.159(USB3-1-RX_P) ; port USB3-1-RX_P
USB3-1-TX_N: Module1.169(USB3-1-TX_N) ; port USB3-1-TX_N
USB3-1-TX_P: Module1.171(USB3-1-TX_P) ; port USB3-1-TX_P
USBOTG: Module1.101(USB_OTG_ID) ; port USBOTG
VBUS_EN: Module1.111(VBUS_EN)

Not connected (* = marked no-connect by the designer): J1 14(UTILITY)*; Module1 134(USB3-0-D_P)* 136(USB3-0-D_N)* 143(HDMI1_HOTPLUG)* 145(HDMI1_SDA)* 146(HDMI1_TX2_P)* 147(HDMI1_SCL)* 148(HDMI1_TX2_N)* 149(HDMI1_CEC)* 152(HDMI1_TX1_P)* 154(HDMI1_TX1_N)* 158(HDMI1_TX0_P)* 160(HDMI1_TX0_N)* 163(USB3-1-D_P)* 164(HDMI1_CLK_P)* 165(USB3-1-D_N)* 166(HDMI1_CLK_N)* 175(MIPI1_D0_N)* 177(MIPI1_D0_P)* 181(MIPI1_D1_N)* 183(MIPI1_D1_P)* 187(MIPI1_C_N)* 189(MIPI1_C_P)* 193(MIPI1_D2_N)* 194(MIPI1_D3_N)* 195(MIPI1_D2_P)* 196(MIPI1_D3_P)*

### Notes on the sheet
- 1
- 2
- 3
- 4
- 5
- 6
- A
- B
- C
- D
- Title: Sheet Title A
- File: Section A - Title A.kicad_sch
- Sheet: /
- ${COMPANY}
- KiCad E.D.A.  kicad (5.1.4)-1
- Size: User
- Date: Last Modified Date
- Rev: ${REVISION}
- Id: 1/1
- (in symbol ComputeModule5-CM5, part B) High Speed Serial

### Library data of the parts
C1 C2 = C: as C64 on sheet Drives_M.2; Value: 100n; Footprint: Capacitor_SMD:C_0603_1608Metric
J1 = HDMI_A: Description: HDMI type A connector; Value: HDMI_A; Footprint: 10029449-111RLF:AMPHENOL_10029449-111RLF
J2 = Conn_01x22_Socket: Part Description: 22 Position FFC, FPC Connector Contacts, Bottom 0.020" (0.50mm) Surface Mount, Right Angle; Field4: Mouser; Field5: 798-FH12-22S-0.5SH55; Field6: FH12-22S-0.5SH55; Field7: Hirose; Value: Conn_01x22_Female; Footprint: Connector_FFC-FPC:Hirose_FH12-22S-0.5SH_1x22-1MP_P0.50mm_Horizontal
Module1 = ComputeModule5-CM5: Part Description: 100 Position Connector Receptacle, Center Strip Contacts Surface Mount Gold; Description: RaspberryPi Compute module 5; Field7: Hirose; Field6: 2x 10164227-1001A1RLF; Value: ComputeModule5-CM5; Footprint: cm5:Raspberry-Pi-5-Compute-Module
U1 = RT9742SNGV: Part Description: Power Switch/Driver 1:1 N-Channel 500mA SOT-23-3; Field4: Farnell; Field5: 2575555; Field7: RichTek; Field8: USWI00155; Field6: RT9742SNGV; Value: RT9742SNGV; Footprint: Package_TO_SOT_SMD:TSOT-23_HandSoldering